# EasyEDA Pro project ORCA Logic Circuit Pro.epro

# Schematic ORCA Logic Circuit
Board Name: ORCA Logic Circuit; Create Date: 2025-01-24; Page Name: Sheet_1; Project Name: ORCA Logic Circuit Pro; Schematic Name: ORCA Logic Circuit; Update Date: 2025-01-24; Add into BOM: yes; Company: Your Company; Convert to PCB: yes; Date: 2025-01-24; Draw By: Nainaiu Rakhaine; REV: 1.0; Sheet: 1/1
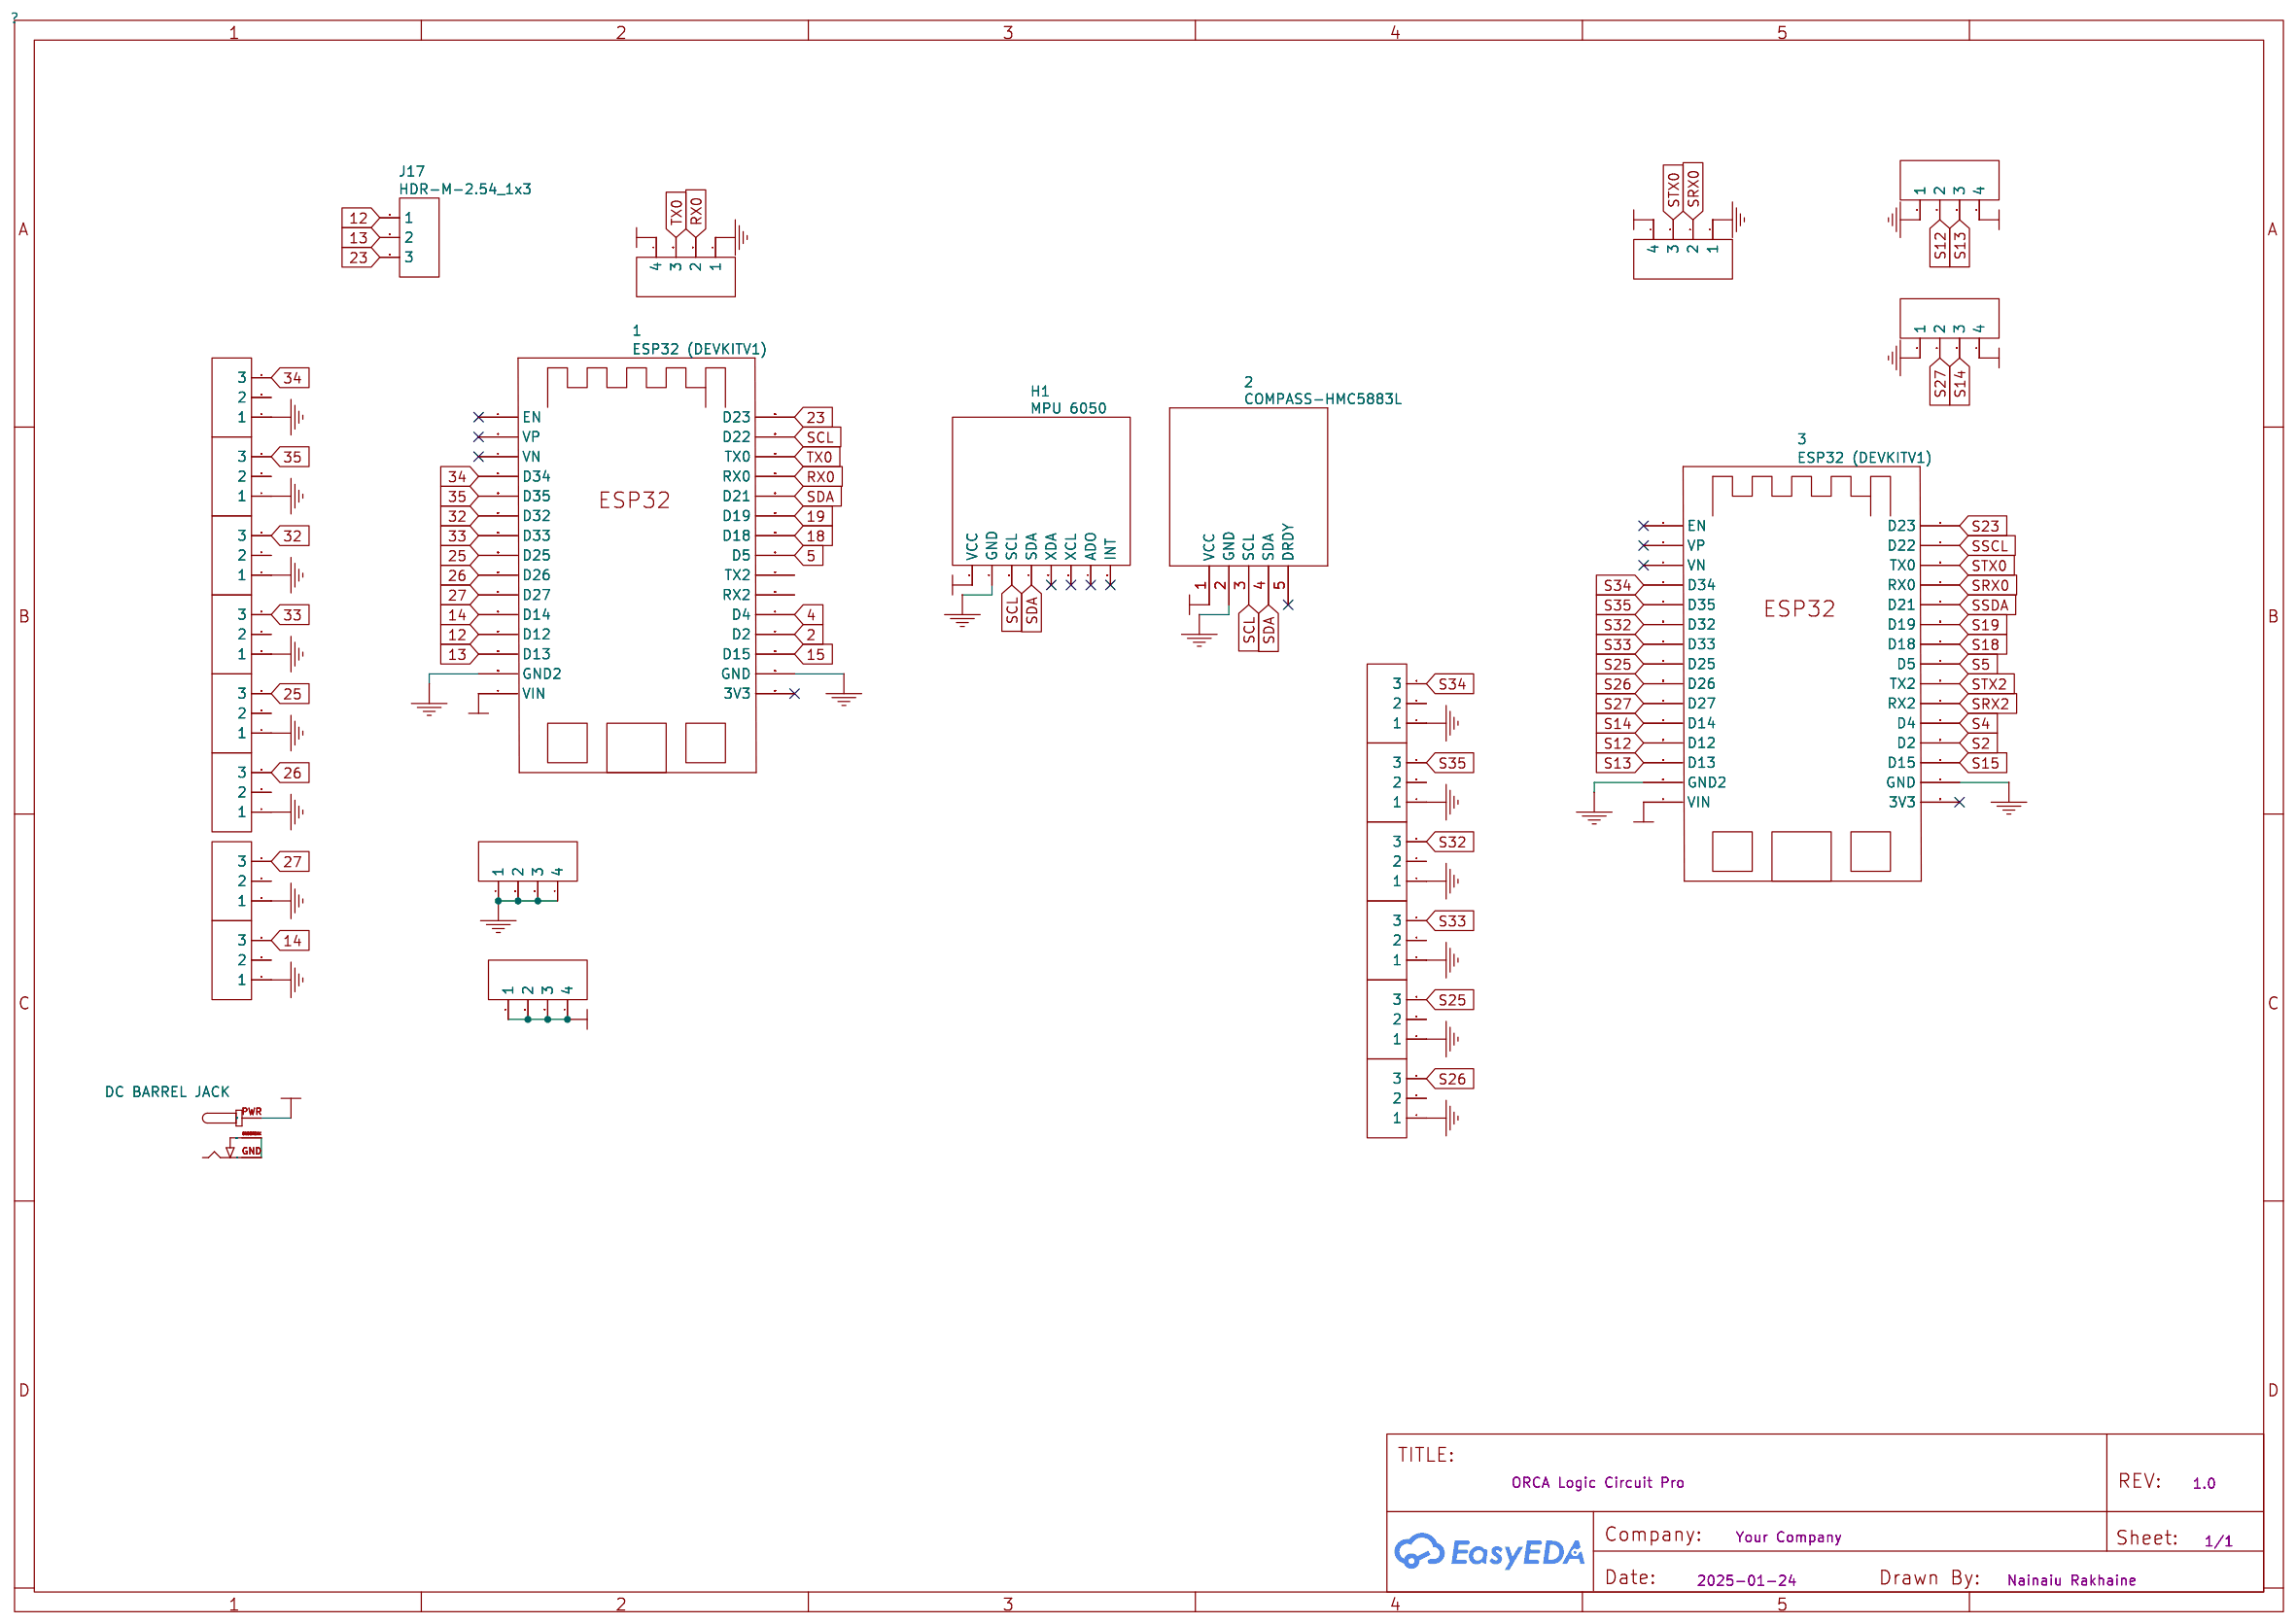
[diagram p0: schematic sheet]

## Parts
1  ESP32 (DEVKITV1)  [ESP32-DEVKIT1]
2  COMPASS-HMC5883L  [COMPASS-HMC5883L]
3  ESP32 (DEVKITV1)  [ESP32-DEVKIT1]
H1  MPU 6050  [MPU6050]
J1  HDR-M-2.54_1x4  [HDR-M-2.54_1X4]
J2  HDR-M-2.54_1x4  [HDR-M-2.54_1X4]
J3  HDR-M-2.54_1x3  [HDR-M-2.54_1X3]
J4  HDR-M-2.54_1x3  [HDR-M-2.54_1X3]
J5  HDR-M-2.54_1x3  [HDR-M-2.54_1X3]
J6  HDR-M-2.54_1x3  [HDR-M-2.54_1X3]
J7  HDR-M-2.54_1x3  [HDR-M-2.54_1X3]
J8  HDR-M-2.54_1x3  [HDR-M-2.54_1X3]
J9  HDR-M-2.54_1x3  [HDR-M-2.54_1X3]
J10  HDR-M-2.54_1x3  [HDR-M-2.54_1X3]
J11  HDR-M-2.54_1x3  [HDR-M-2.54_1X3]
J12  HDR-M-2.54_1x3  [HDR-M-2.54_1X3]
J13  HDR-M-2.54_1x3  [HDR-M-2.54_1X3]
J14  HDR-M-2.54_1x3  [HDR-M-2.54_1X3]
J15  HDR-M-2.54_1x4  [HDR-M-2.54_1X4]
J16  HDR-M-2.54_1x4  [HDR-M-2.54_1X4]
J17  HDR-M-2.54_1x3  [HDR-M-2.54_1X3]
J18  HDR-M-2.54_1x4  [HDR-M-2.54_1X4]
J19  HDR-M-2.54_1x3  [HDR-M-2.54_1X3]
J21  HDR-M-2.54_1x3  [HDR-M-2.54_1X3]
J22  HDR-M-2.54_1x4  [HDR-M-2.54_1X4]
U2  DC BARREL JACK  [DCBARRELJACK]

## Library data of the parts
1 3 = ESP32 (DEVKITV1)
2 = COMPASS-HMC5883L
H1 = MPU 6050: Supplier Part: C225505; Supplier: LCSC
J1 J2 J15 J16 J18 J22 = HDR-M-2.54_1x4: Supplier Part: C124378; Supplier: LCSC
J3-J14 J17 J19 J21 = HDR-M-2.54_1x3: Supplier Part: C180248; Supplier: LCSC
U2 = DC BARREL JACK

## Nets
+5V: 1.VIN 2.1(VCC) 3.VIN H1.1(VCC) J1.4 J15.1 J15.2 J15.3 J15.4 J16.4 J18.4 J22.4 U2.PWR
GND: 1.GND 1.GND2 2.2(GND) 3.GND 3.GND2 H1.2(GND) J1.1 J2.1 J2.2 J2.3 J2.4 J3.1 J4.1 J5.1 J6.1 J7.1 J8.1 J9.1 J10.1 J11.1 J12.1 J13.1 J14.1 J16.1 J18.1 J19.1 J21.1 J22.1
2: 1.D2
4: 1.D4
5: 1.D5
12: 1.D12 J17.1
13: 1.D13 J17.2
14: 1.D14 J5.3
15: 1.D15
18: 1.D18
19: 1.D19
23: 1.D23 J17.3
25: 1.D25 J8.3
26: 1.D26 J7.3
27: 1.D27 J6.3
32: 1.D32 J3.3
33: 1.D33 J4.3
34: 1.D34 J14.3
35: 1.D35 J13.3
RX0: 1.RX0 J16.2
S2: 3.D2
S4: 3.D4
S5: 3.D5
S12: 3.D12 J1.2
S13: 3.D13 J1.3
S14: 3.D14 J22.3
S15: 3.D15
S18: 3.D18
S19: 3.D19
S23: 3.D23
S25: 3.D25 J19.3
S26: 3.D26 J21.3
S27: 3.D27 J22.2
S32: 3.D32 J11.3
S33: 3.D33 J12.3
S34: 3.D34 J9.3
S35: 3.D35 J10.3
SCL: 1.D22 2.3(SCL) H1.3(SCL)
SDA: 1.D21 2.4(SDA) H1.4(SDA)
SRX0: 3.RX0 J18.2
SRX2: 3.RX2
SSCL: 3.D22
SSDA: 3.D21
STX0: 3.TX0 J18.3
STX2: 3.TX2
TX0: 1.TX0 J16.3
Net-(U2-GND): U2.GND U2.GNDBREAK

Not connected (* = marked no-connect by the designer): 1 3V3* EN* RX2 TX2 VN* VP*; 2 5(DRDY)*; 3 3V3* EN* VN* VP*; H1 5(XDA)* 6(XCL)* 7(ADO)* 8(INT)*; J3 2; J4 2; J5 2; J6 2; J7 2; J8 2; J9 2; J10 2; J11 2; J12 2; J13 2; J14 2; J19 2; J21 2

# Board PCB2
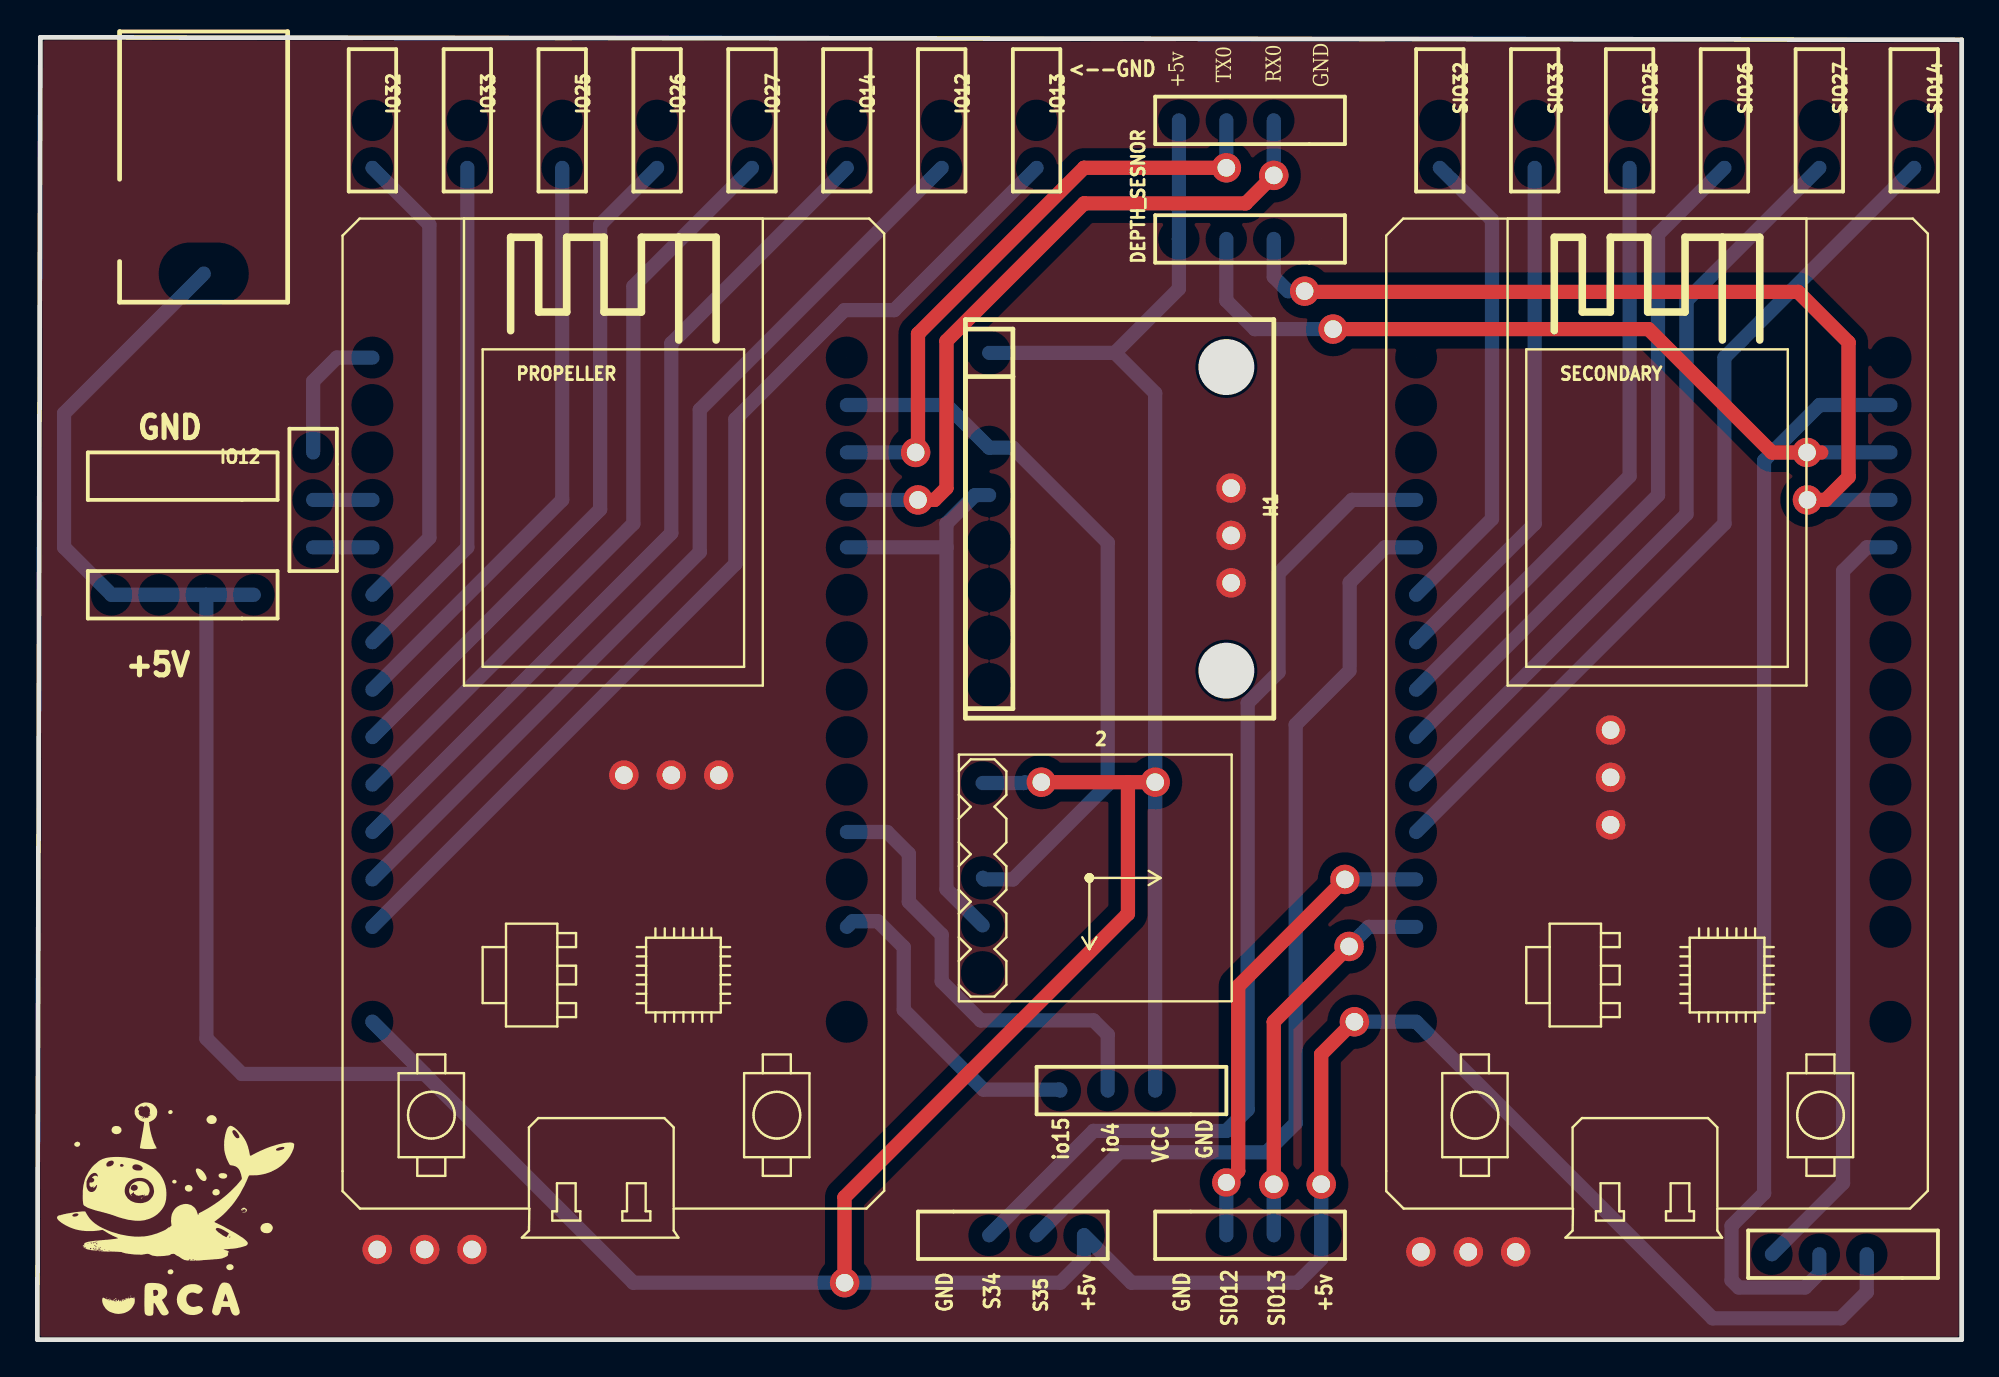
[diagram p1: board, top side]
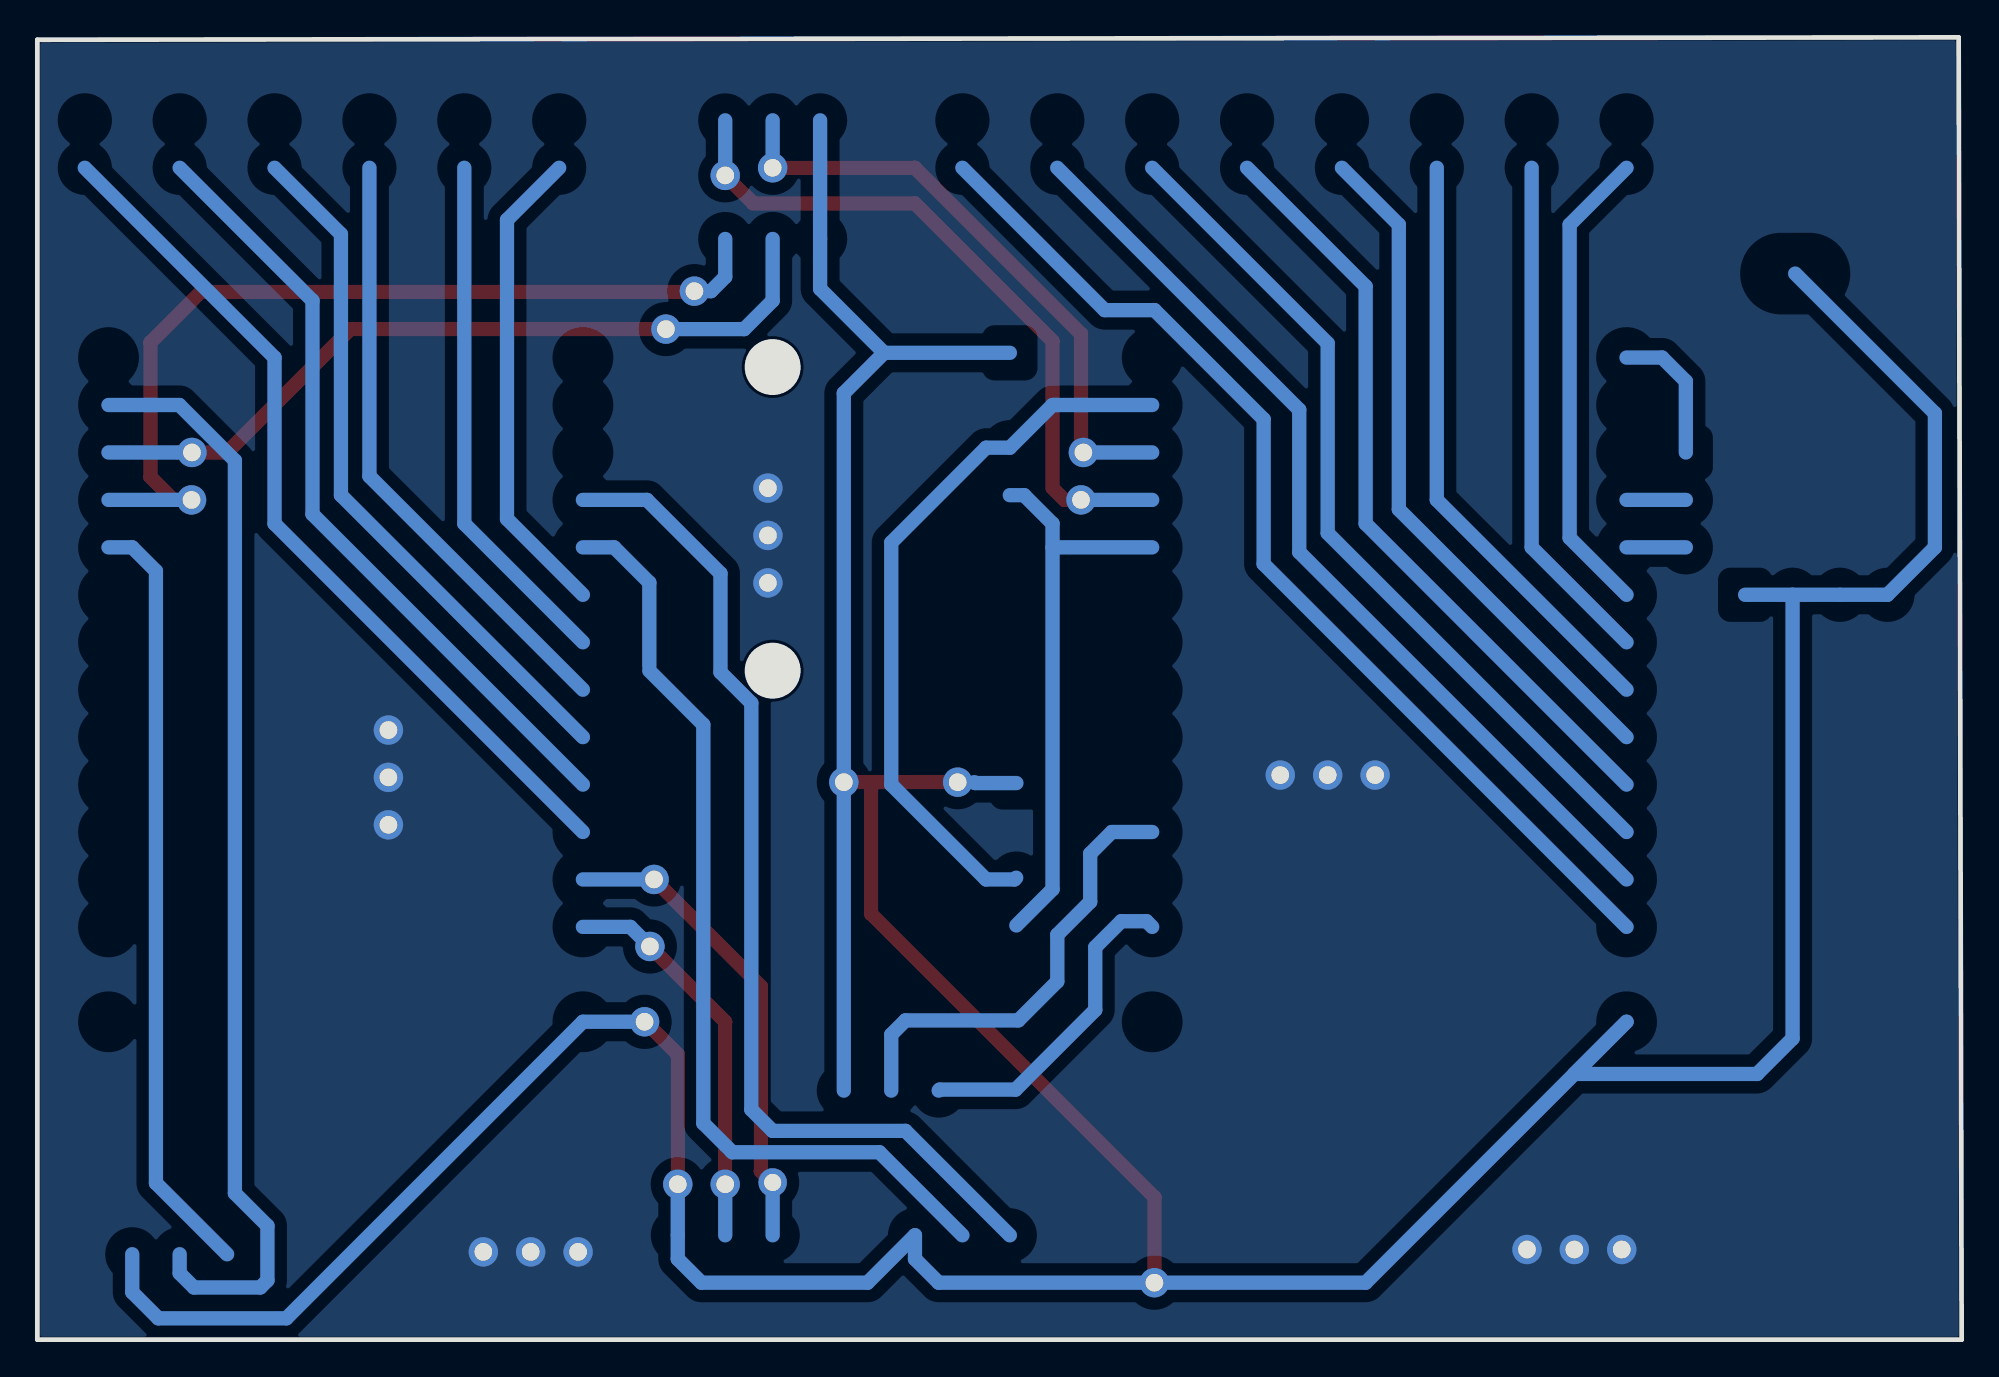
[diagram p2: board, bottom side, seen from below]

Outline 103.03 x 69.72 mm; copper layers: Top Layer, Bottom Layer. Coordinates in mm from the lower left corner of the outline.
Outline path: 0,0 0.16,69.72 103.03,69.59 103.03,0 0,0
Stack: Top Layer 0.035mm / Dielectric1 1.51mm FR4 er 4.5 / Bottom Layer 0.035mm

## Design rules (mm)
template: Custom Config
spacing copperThickness1oz (default): track to track 0.102, other pairs 0.152 to 0.3
spacing copperThickness2oz: track to track 0.203, other pairs 0.152 to 0.3
track width copperThickness1oz (default): min 0.127, default 0.254, max 2.54
track width copperThickness2oz: min 0.203, default 0.254, max 2.54
differential pair differentialPair (default): width min 0.127, default 0.254, max 2.54; gap min 0.152, default 0.152
via viaSize (default): diameter min 0.5, default 0.61, max 10; hole min 0.3, default 0.305, max 6.299
pour e205 uses copperRegion
pour e206 uses copperRegion

## Placement (name value [footprint] x y rotation side)
2  -  [COMPASS-HMC5883L]  56.04 24.64 0 top
+5V  HDR-M-2.54_1x4  [HDR-M-2.54_1X4]  7.78 39.88 180 top
DEPTH_SESNOR  HDR-M-2.54_1x4  [HDR-M-2.54_1X4]  64.93 65.28 180 top
DEPTH_SESNOR2  HDR-M-2.54_1x4  [HDR-M-2.54_1X4]  64.93 58.93 180 top
GND  HDR-M-2.54_1x4  [HDR-M-2.54_1X4]  7.78 46.23 180 top
H1  MPU 6050  [MPU6050]  58.58 48.77 270 top
IO12  -  [HDR-M-2.54_1X3]  48.42 65.28 270 top
IO12#2  -  [HDR-M-2.54_1X3]  14.77 44.96 270 top
IO13  HDR-M-2.54_1x3  [HDR-M-2.54_1X3]  53.5 65.28 270 top
IO14  HDR-M-2.54_1x3  [HDR-M-2.54_1X3]  43.34 65.28 270 top
IO25  HDR-M-2.54_1x3  [HDR-M-2.54_1X3]  28.1 65.28 270 top
IO26  HDR-M-2.54_1x3  [HDR-M-2.54_1X3]  33.18 65.28 270 top
IO27  HDR-M-2.54_1x3  [HDR-M-2.54_1X3]  38.26 65.28 270 top
IO32  HDR-M-2.54_1x3  [HDR-M-2.54_1X3]  17.94 65.28 270 top
IO33  HDR-M-2.54_1x3  [HDR-M-2.54_1X3]  23.02 65.28 270 top
J1  -  [HDR-M-2.54_1X4]  96.68 4.57 180 top
J1#2  -  [HDR-M-2.54_1X4]  64.93 5.59 0 top
J1#3  -  [HDR-M-2.54_1X4]  58.58 13.34 180 top
NOREF  -  [Pad_e2337]  74.08 4.7 180 top
NOREF#2  -  [Pad_e2336]  84.24 32.64 270 top
NOREF#3  -  [Pad_e806]  53.76 29.85 180 top
NOREF#4  -  [Pad_e861]  69.38 54.1 180 top
NOREF#5  -  [Pad_e946]  94.75 47.5 180 top
NOREF#6  -  [Pad_e2331]  63.92 40.52 270 top
NOREF#7  -  [Pad_e2341]  20.74 4.83 180 top
NOREF#8  -  [Pad_e2329]  33.94 30.23 180 top
NOREF#9  -  [Pad_e1261]  43.22 3.05 180 top
NOREF#10  -  [Pad_e2334]  84.24 27.56 270 top
NOREF#11  -  [Pad_e2330]  36.48 30.23 180 top
NOREF#12  -  [Pad_e1028]  66.2 8.32 180 top
NOREF#13  -  [Pad_e998]  94.78 44.96 180 top
NOREF#14  -  [Pad_e2328]  31.4 30.23 180 top
NOREF#15  -  [Pad_e2333]  63.92 45.59 270 top
NOREF#16  -  [Pad_e2335]  84.24 30.1 270 top
NOREF#17  -  [Pad_e862]  67.85 56.13 180 top
NOREF#18  -  [Pad_e1034]  68.74 8.32 180 top
NOREF#19  -  [Pad_e2342]  23.27 4.83 180 top
NOREF#20  -  [Pad_e1041]  70.01 24.64 180 top
NOREF#21  -  [Pad_e1057]  70.52 17.02 180 top
NOREF#22  -  [Pad_e837]  47.03 47.5 180 top
NOREF#23  -  [Pad_e2340]  18.2 4.83 180 top
NOREF#24  -  [Pad_e1042]  70.23 21.05 180 top
NOREF#25  -  [Pad_e2339]  79.15 4.7 180 top
NOREF#26  -  [Pad_e2332]  63.92 43.06 270 top
NOREF#27  -  [Pad_e852]  66.2 62.33 180 top
NOREF#28  -  [Pad_e1078]  59.85 29.85 180 top
NOREF#29  -  [Pad_e2338]  76.62 4.7 180 top
NOREF#30  -  [Pad_e836]  47.15 44.96 180 top
NOREF#31  -  [Pad_e368]  63.66 8.42 0 top
NOREF#32  -  [Pad_e851]  63.66 62.74 180 top
PROPELLER  ESP32 (DEVKITV1)  [ESP32-DEVKIT1]  30.64 34.8 0 top
S35  HDR-M-2.54_1x4  [HDR-M-2.54_1X4]  52.23 5.59 0 top
SECONDARY  ESP32 (DEVKITV1)  [ESP32-DEVKIT1]  86.52 34.8 0 top
SIO14  HDR-M-2.54_1x3  [HDR-M-2.54_1X3]  100.49 65.28 270 top
SIO25  HDR-M-2.54_1x3  [HDR-M-2.54_1X3]  85.25 65.28 270 top
SIO26  HDR-M-2.54_1x3  [HDR-M-2.54_1X3]  90.33 65.28 270 top
SIO27  HDR-M-2.54_1x3  [HDR-M-2.54_1X3]  95.41 65.28 270 top
SIO32  HDR-M-2.54_1x3  [HDR-M-2.54_1X3]  75.09 65.28 270 top
SIO33  HDR-M-2.54_1x3  [HDR-M-2.54_1X3]  80.17 65.28 270 top
U2  DC BARREL JACK  [DCBARRELJACK]  6.51 60.2 270 top

## Footprints (pads in the part's own frame, mm; a bottom-side part is the same pattern mirrored in y, then rotated)
COMPASS-HMC5883L
  rect 0.003x0.003 hole 1x1: 1(-5.43,5.16)
  round 0.003 hole 1x1: 2(-5.43,2.62) 3(-5.43,0.08) 4(-5.43,-2.46) 5(-5.43,-5)
DCBARRELJACK
  oval 0.003x0.003 hole 2x3.5: GND(-3.125,2.4) PWR(3.125,2.4)
  oval 0.003x0.003 hole 3.5x2: GNDBREAK(0.275,-2.4)
ESP32-DEVKIT1
  round 0.003 hole 0.914: 3V3(12.7,-17.78) D2(12.7,-10.16) D4(12.7,-7.62) D5(12.7,0) D12(-12.7,-10.16) D13(-12.7,-12.7) D14(-12.7,-7.62) D15(12.7,-12.7) D18(12.7,2.54) D19(12.7,5.08) D21(12.7,7.62) D22(12.7,15.24) D23(12.7,17.78) D25(-12.7,0) D26(-12.7,-2.54) D27(-12.7,-5.08) D32(-12.7,5.08) D33(-12.7,2.54) D34(-12.7,10.16) D35(-12.7,7.62) EN(-12.7,17.78) GND(12.7,-15.24) GND2(-12.7,-15.24) RX0(12.7,10.16) RX2(12.7,-5.08) TX0(12.7,12.7) TX2(12.7,-2.54) VIN(-12.7,-17.78) VN(-12.7,12.7) VP(-12.7,15.24)
HDR-M-2.54_1X3
  rect 0.003x0.003 hole 0.889: 1(-2.54,0)
  round 0.003 hole 0.889: 2(0,0) 3(2.54,0)
HDR-M-2.54_1X4
  rect 0.003x0.003 hole 0.889: 1(-3.81,0)
  round 0.003 hole 0.889: 2(-1.27,0) 3(1.27,0) 4(3.81,0)
MPU6050
  rect 0.003x0.003 hole 1.021: 1(-4.064,-7.62)
  round 0.003 hole 1.021: 2(-1.524,-7.62) 3(1.016,-7.62) 4(3.556,-7.62) 5(6.096,-7.62) 6(8.636,-7.62) 7(11.176,-7.62) 8(13.716,-7.62)
Pad_e368
  round 1.524 hole 0.914: 1(0,0)
Pad_e806
  round 1.575 hole 0.945: 1(0,0)
Pad_e836
  round 1.575 hole 0.945: 1(0,0)
Pad_e837
  round 1.575 hole 0.945: 2(0,0)
Pad_e851
  round 1.575 hole 0.945: 1(0,0)
Pad_e852
  round 1.575 hole 0.945: 2(0,0)
Pad_e861
  round 1.575 hole 0.945: 1(0,0)
Pad_e862
  round 1.575 hole 0.945: 2(0,0)
Pad_e946
  round 1.575 hole 0.945: 1(0,0)
Pad_e998
  round 1.575 hole 0.945: 1(0,0)
Pad_e1028
  round 1.575 hole 0.945: 2(0,0)
Pad_e1034
  round 1.575 hole 0.945: 3(0,0)
Pad_e1041
  round 1.575 hole 0.945: 1(0,0)
Pad_e1042
  round 1.575 hole 0.945: 2(0,0)
Pad_e1057
  round 1.575 hole 0.945: 1(0,0)
Pad_e1078
  round 1.575 hole 0.945: 1(0,0)
Pad_e1261
  round 1.575 hole 0.945: 1(0,0)
Pad_e2328
  round 1.575 hole 0.945: 1(0,0)
Pad_e2329
  round 1.575 hole 0.945: 1(0,0)
Pad_e2330
  round 1.575 hole 0.945: 1(0,0)
Pad_e2331
  round 1.575 hole 0.945: 1(0,0)
Pad_e2332
  round 1.575 hole 0.945: 1(0,0)
Pad_e2333
  round 1.575 hole 0.945: 1(0,0)
Pad_e2334
  round 1.575 hole 0.945: 1(0,0)
Pad_e2335
  round 1.575 hole 0.945: 1(0,0)
Pad_e2336
  round 1.575 hole 0.945: 1(0,0)
Pad_e2337
  round 1.575 hole 0.945: 1(0,0)
Pad_e2338
  round 1.575 hole 0.945: 1(0,0)
Pad_e2339
  round 1.575 hole 0.945: 1(0,0)
Pad_e2340
  round 1.575 hole 0.945: 1(0,0)
Pad_e2341
  round 1.575 hole 0.945: 1(0,0)
Pad_e2342
  round 1.575 hole 0.945: 1(0,0)

## Nets
+5V: 2.1 +5V.1 +5V.2 +5V.3 +5V.4 DEPTH_SESNOR.4 DEPTH_SESNOR2.4 H1.1 J1.2 J1#2.4 J1#3.2 NOREF#3.1 NOREF#9.1 NOREF#18.3 NOREF#21.1 NOREF#28.1 PROPELLER.VIN S35.4 SECONDARY.VIN U2.PWR
GND: 2.2 DEPTH_SESNOR.1 DEPTH_SESNOR2.1 GND.1 GND.2 GND.3 GND.4 H1.2 IO12.1 IO13.1 IO14.1 IO25.1 IO26.1 IO27.1 IO32.1 IO33.1 J1.1 J1#2.1 J1#3.1 NOREF.1 NOREF#2.1 NOREF#6.1 NOREF#7.1 NOREF#8.1 NOREF#10.1 NOREF#11.1 NOREF#14.1 NOREF#15.1 NOREF#16.1 NOREF#19.1 NOREF#23.1 NOREF#25.1 NOREF#26.1 NOREF#29.1 PROPELLER.GND PROPELLER.GND2 S35.1 SECONDARY.GND SECONDARY.GND2 SIO14.1 SIO25.1 SIO26.1 SIO27.1 SIO32.1 SIO33.1 U2.GND U2.GNDBREAK
1_RX2: PROPELLER.RX2
1_TX2: PROPELLER.TX2
2: PROPELLER.D2
4: J1#3.3 PROPELLER.D4
5: PROPELLER.D5
12: IO12.3 PROPELLER.D12
13: IO13.3 PROPELLER.D13
14: IO14.3 PROPELLER.D14
15: J1#3.4 PROPELLER.D15
18: PROPELLER.D18
19: PROPELLER.D19
23: PROPELLER.D23
25: IO25.3 PROPELLER.D25
26: IO26.3 PROPELLER.D26
27: IO27.3 PROPELLER.D27
32: IO32.3 PROPELLER.D32
33: IO33.3 PROPELLER.D33
34: IO12#2.2 PROPELLER.D34
35: IO12#2.3 PROPELLER.D35
EN: IO12#2.1 PROPELLER.EN
J3_2: IO25.2
J4_2: IO26.2
J5_2: IO13.2
J6_2: IO12.2
J7_2: IO14.2
J8_2: IO27.2
J9_2: SIO32.2
J10_2: SIO33.2
J11_2: SIO25.2
J12_2: SIO26.2
J13_2: IO33.2
J14_2: IO32.2
J19_2: SIO27.2
J21_2: SIO14.2
RX0: DEPTH_SESNOR.2 NOREF#27.2 NOREF#30.1 PROPELLER.RX0
S2: SECONDARY.D2
S4: SECONDARY.D4
S5: SECONDARY.D5
S12: J1#2.2 NOREF#20.1 NOREF#31.1 SECONDARY.D12
S13: J1#2.3 NOREF#12.2 NOREF#24.2 SECONDARY.D13
S14: SECONDARY.D14 SIO14.3
S15: SECONDARY.D15
S18: SECONDARY.D18
S19: SECONDARY.D19
S23: SECONDARY.D23
S25: SECONDARY.D25 SIO25.3
S26: SECONDARY.D26 SIO26.3
S27: SECONDARY.D27 SIO27.3
S32: SECONDARY.D32 SIO32.3
S33: SECONDARY.D33 SIO33.3
S34: S35.2 SECONDARY.D34
S35: S35.3 SECONDARY.D35
SCL: 2.3 H1.3 PROPELLER.D22
SDA: 2.4 H1.4 PROPELLER.D21
SRX0: DEPTH_SESNOR2.2 NOREF#13.1 NOREF#17.2 SECONDARY.RX0
SRX2: SECONDARY.RX2
SSCL: J1.3 SECONDARY.D22
SSDA: J1.4 SECONDARY.D21
STX0: DEPTH_SESNOR2.3 NOREF#4.1 NOREF#5.1 SECONDARY.TX0
STX2: SECONDARY.TX2
TX0: DEPTH_SESNOR.3 NOREF#22.2 NOREF#32.1 PROPELLER.TX0

Pads without a net: 2 5; H1 5 6 7 8; PROPELLER 3V3 VN VP; SECONDARY 3V3 EN VN VP

## Routing (per net, layer and track width the routed paths; a pad name or vN(x,y) marks a point on that pad's centre or on a via; arc(x,y) is an arc through that point)
+5V: length 281.3
  Top Layer w0.762: 58.39,29.85 59.47,29.85 59.6,29.97 ; 58.39,29.85 58.39,22.8 43.22,7.62 43.22,3.18 ; 58.39,29.85 NOREF#3.1 ; 70.48,17.02 68.74,15.28 68.74,8.45
  Bottom Layer w0.762: 57.69,52.83 61.12,56.26 DEPTH_SESNOR2.4 DEPTH_SESNOR.4 ; 57.69,52.83 H1.1 ; 57.69,52.83 59.85,50.67 NOREF#28.1 J1#3.2 ; 70.48,17.02 SECONDARY.VIN 89.7,1.14 96.56,1.14 97.95,2.54 J1.2 ; U2.PWR 1.43,49.59 1.43,42.42 +5V.4 +5V.3 +5V.2 ; 2.1 52.82,29.8 52.87,29.85 ; 68.74,8.45 J1#2.4 68.74,4.32 67.47,3.05 58.58,3.05 S35.4 56.04,4.32 54.77,3.05 NOREF#9.1 31.91,3.05 PROPELLER.VIN 20.74,14.22 10.95,14.22 9.05,16.12 +5V.2 ; +5V.2 +5V.1
4: length 24.4
  Bottom Layer w0.762: PROPELLER.D4 45.5,27.18 46.66,26.02 46.66,23.44 48.42,21.68 48.42,19.18 50.51,17.09 56.55,17.09 57.31,16.33 J1#3.3
12: length 50.7
  Bottom Layer w0.762: IO12.3 35.47,49.78 35.47,42.16 PROPELLER.D12
13: length 56.9
  Bottom Layer w0.762: IO13.3 45.88,55.12 43.22,55.12 37.37,49.28 37.37,41.53 PROPELLER.D13
14: length 46.1
  Bottom Layer w0.762: IO14.3 33.94,53.34 33.94,43.18 PROPELLER.D14
15: length 17.3
  Bottom Layer w0.762: J1#3.4 54.72,13.39 50.66,13.39 46.39,17.65 46.39,21.01 44.99,22.4 43.65,22.4 PROPELLER.D15
25: length 32.1
  Bottom Layer w0.762: IO25.3 28.1,44.96 PROPELLER.D25
26: length 36.8
  Bottom Layer w0.762: IO26.3 30.13,59.69 30.13,44.45 PROPELLER.D26
27: length 41.4
  Bottom Layer w0.762: IO27.3 31.91,56.39 31.91,43.69 PROPELLER.D27
32: length 25.4
  Bottom Layer w0.762: IO32.3 20.99,59.69 20.99,42.93 PROPELLER.D32
33: length 27.5
  Bottom Layer w0.762: IO33.3 23.02,42.42 PROPELLER.D33
34: length 3.2
  Bottom Layer w0.762: PROPELLER.D34 IO12#2.2
35: length 3.2
  Bottom Layer w0.762: PROPELLER.D35 IO12#2.3
EN: length 7.5
  Bottom Layer w0.762: IO12#2.1 14.77,51.31 16.04,52.58 PROPELLER.EN
RX0: length 37.6
  Top Layer w0.762: NOREF#27.2 64.7,60.83 56.04,60.83 48.68,53.47 48.68,45.59 48.04,44.96 NOREF#30.1
  Bottom Layer w0.762: NOREF#27.2 DEPTH_SESNOR.2 ; PROPELLER.RX0 NOREF#30.1
S12: length 25.5
  Top Layer w0.762: 63.66,8.38 64.3,9.02 64.3,18.92 NOREF#20.1
  Bottom Layer w0.762: J1#2.2 NOREF#31.1 ; NOREF#20.1 SECONDARY.D12
S13: length 21.2
  Top Layer w0.762: 66.2,8.45 66.2,17.02 NOREF#24.2
  Bottom Layer w0.762: SECONDARY.D13 71.28,22.1 NOREF#24.2 ; J1#2.3 66.2,8.45
S14: length 46.6
  Bottom Layer w0.762: SIO14.3 90.33,52.58 90.33,43.69 SECONDARY.D14
S25: length 32.7
  Bottom Layer w0.762: SECONDARY.D25 85.25,46.23 SIO25.3
S26: length 37.3
  Bottom Layer w0.762: SECONDARY.D26 86.78,45.21 86.78,59.18 SIO26.3
S27: length 42
  Bottom Layer w0.762: SIO27.3 88.3,55.63 88.3,44.2 SECONDARY.D27
S32: length 25.7
  Bottom Layer w0.762: SIO32.3 77.89,59.94 77.89,43.94 SECONDARY.D32
S33: length 28
  Bottom Layer w0.762: SECONDARY.D33 80.17,43.69 SIO33.3
S34: length 55
  Bottom Layer w0.762: S35.2 56.55,11.18 63.66,11.18 64.81,12.32 64.81,34.08 66.46,35.73 66.46,41.02 70.39,44.96 SECONDARY.D34
S35: length 50.6
  Bottom Layer w0.762: 70.27,36.07 70.27,40.53 72.15,42.42 SECONDARY.D35 ; S35.3 57.95,10.03 65.82,10.03 67.38,11.59 67.38,32.92 70.27,35.81
SCL: length 38.8
  Bottom Layer w0.762: 50.62,24.73 50.72,24.64 52.23,24.64 57.31,29.72 57.31,42.67 52.23,47.75 H1.3 48.68,50.04 PROPELLER.D22
SDA: length 30.6
  Bottom Layer w0.762: 48.68,42.42 48.68,43.69 50.2,45.21 H1.4 ; 48.68,42.42 48.68,24.11 2.4 ; 48.68,42.42 PROPELLER.D21
SRX0: length 49.2
  Top Layer w0.762: 67.77,56.09 94.27,56.09 96.98,53.39 96.98,46.19 95.75,44.96 94.52,44.96
  Bottom Layer w0.762: DEPTH_SESNOR2.2 66.2,56.9 66.96,56.13 NOREF#17.2 ; 94.52,44.96 SECONDARY.RX0
SSCL: length 58.8
  Bottom Layer w0.762: SECONDARY.D22 95.43,50.04 92.45,47.07 92.45,7.84 90.71,6.1 90.71,3.18 91.09,2.79 94.65,2.79 95.41,3.56 J1.3
SSDA: length 41.2
  Bottom Layer w0.762: SECONDARY.D21 97.95,42.42 96.68,41.15 96.68,8.38 J1.4
STX0: length 42.3
  Top Layer w0.762: 95.52,47.5 92.87,47.5 86.27,54.1 69.5,54.1 69.38,54.23
  Bottom Layer w0.762: DEPTH_SESNOR2.3 63.66,55.63 65.19,54.1 NOREF#4.1 ; 95.52,47.5 SECONDARY.TX0
TX0: length 32.7
  Top Layer w0.762: NOREF#32.1 56.04,62.74 47.15,53.85 47.15,47.75 46.9,47.5
  Bottom Layer w0.762: NOREF#32.1 DEPTH_SESNOR.3 ; PROPELLER.TX0 46.9,47.5

## Copper pours and planes (outline as drawn; the poured copper is in the pictures)
GND on Top Layer: -3.65,71.63 104.3,71.63 104.3,-1.75 -3.65,-0.98
GND on Bottom Layer: -1.11,70.36 104.3,70.36 104.3,-3.68 -1.11,-3.68

## Text on the board
Top Silkscreen Layer: GND | S34 | io15 | +5v | io4 | VCC | SIO12 | SIO13 | <--GND | TX0 | RX0

# Board PCB3
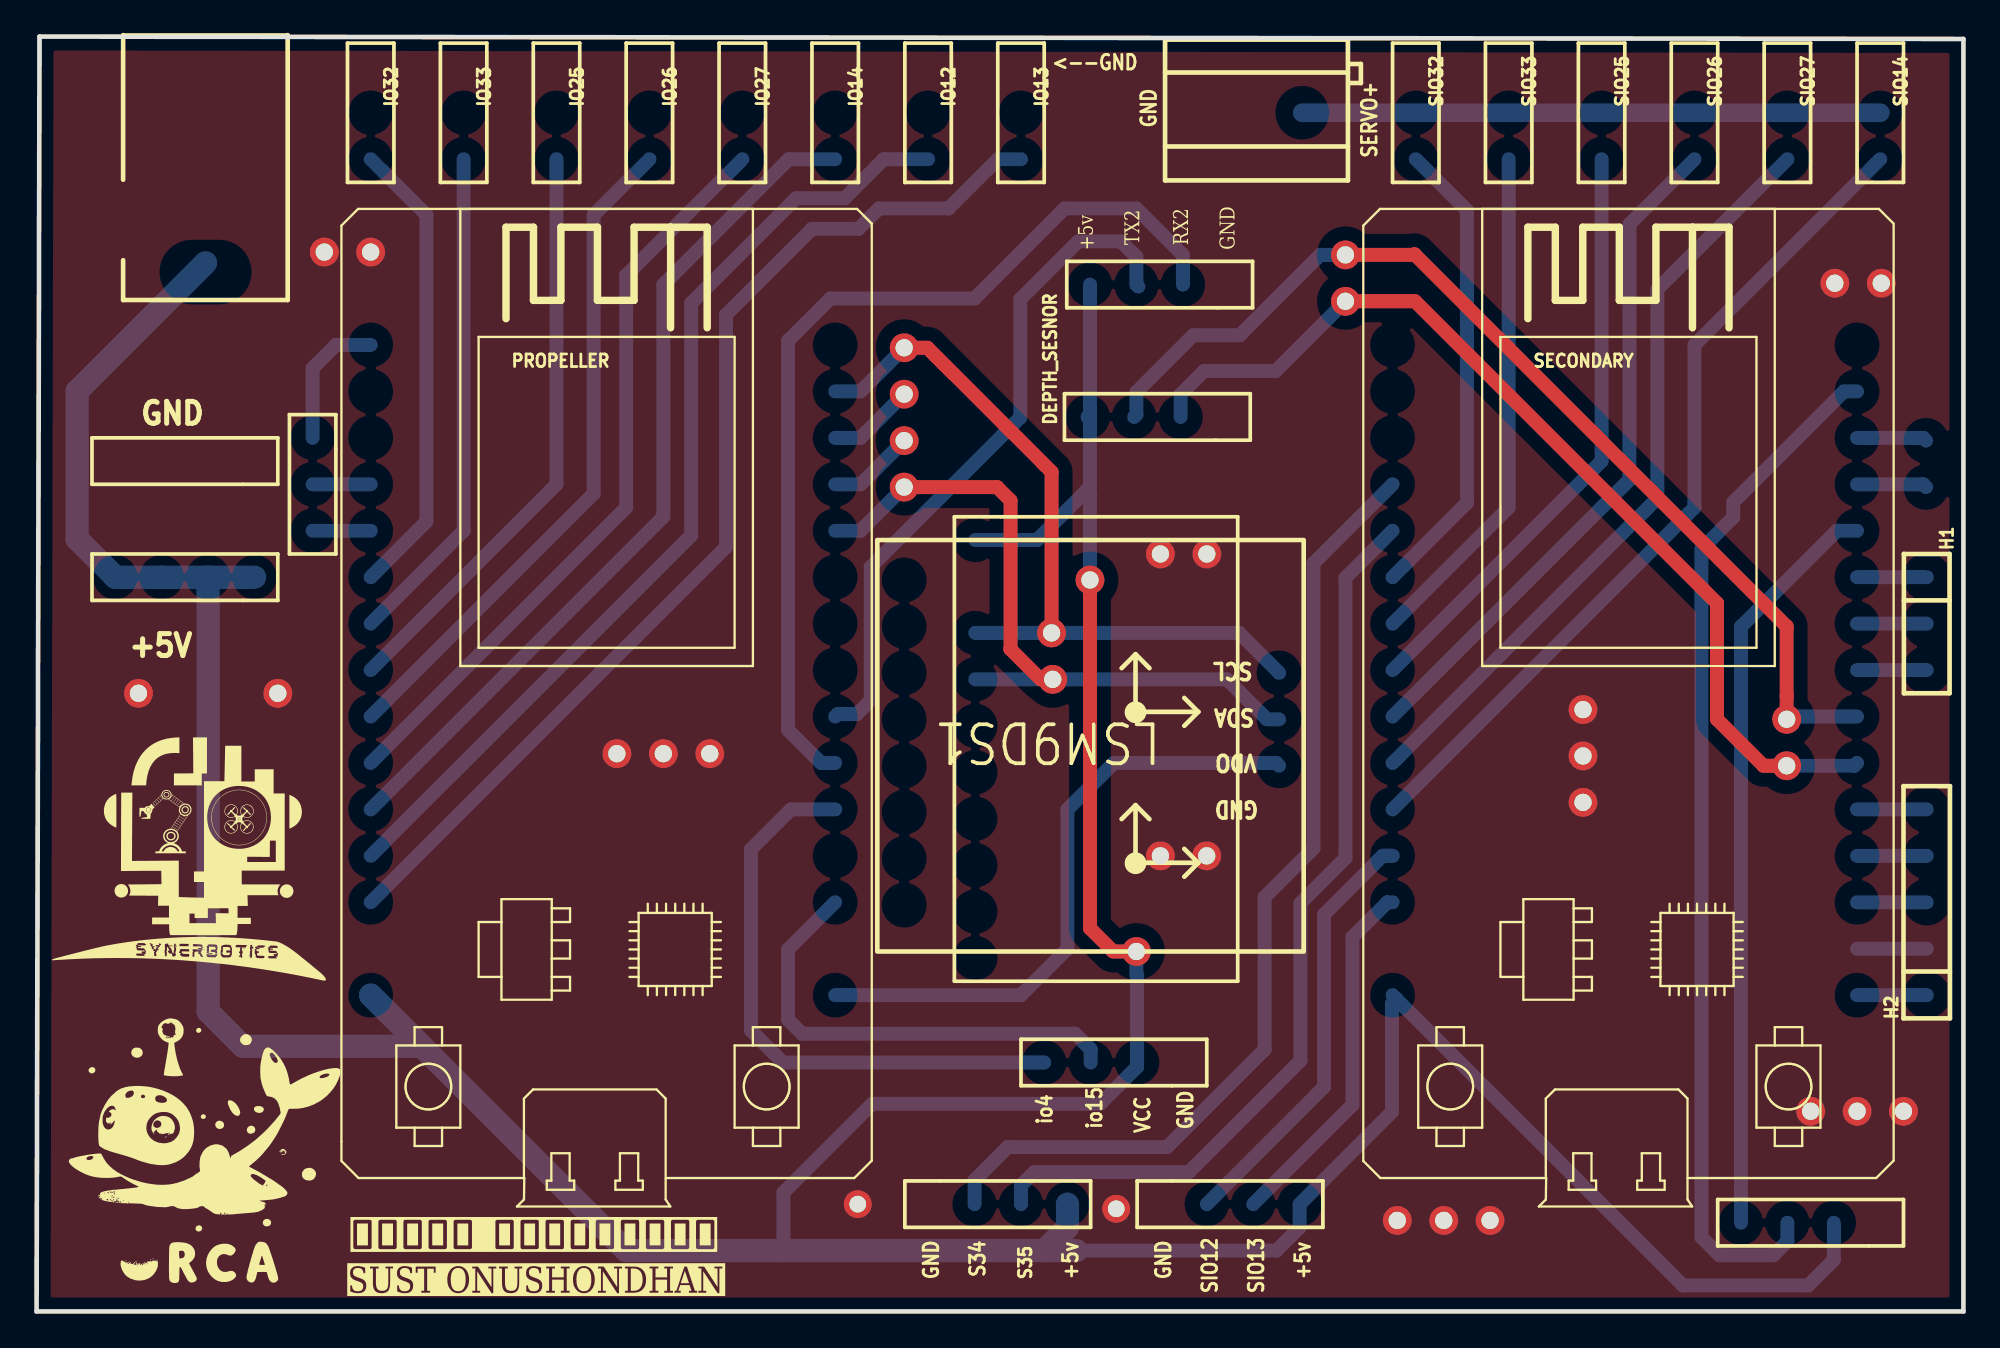
[diagram p3: board, top side]
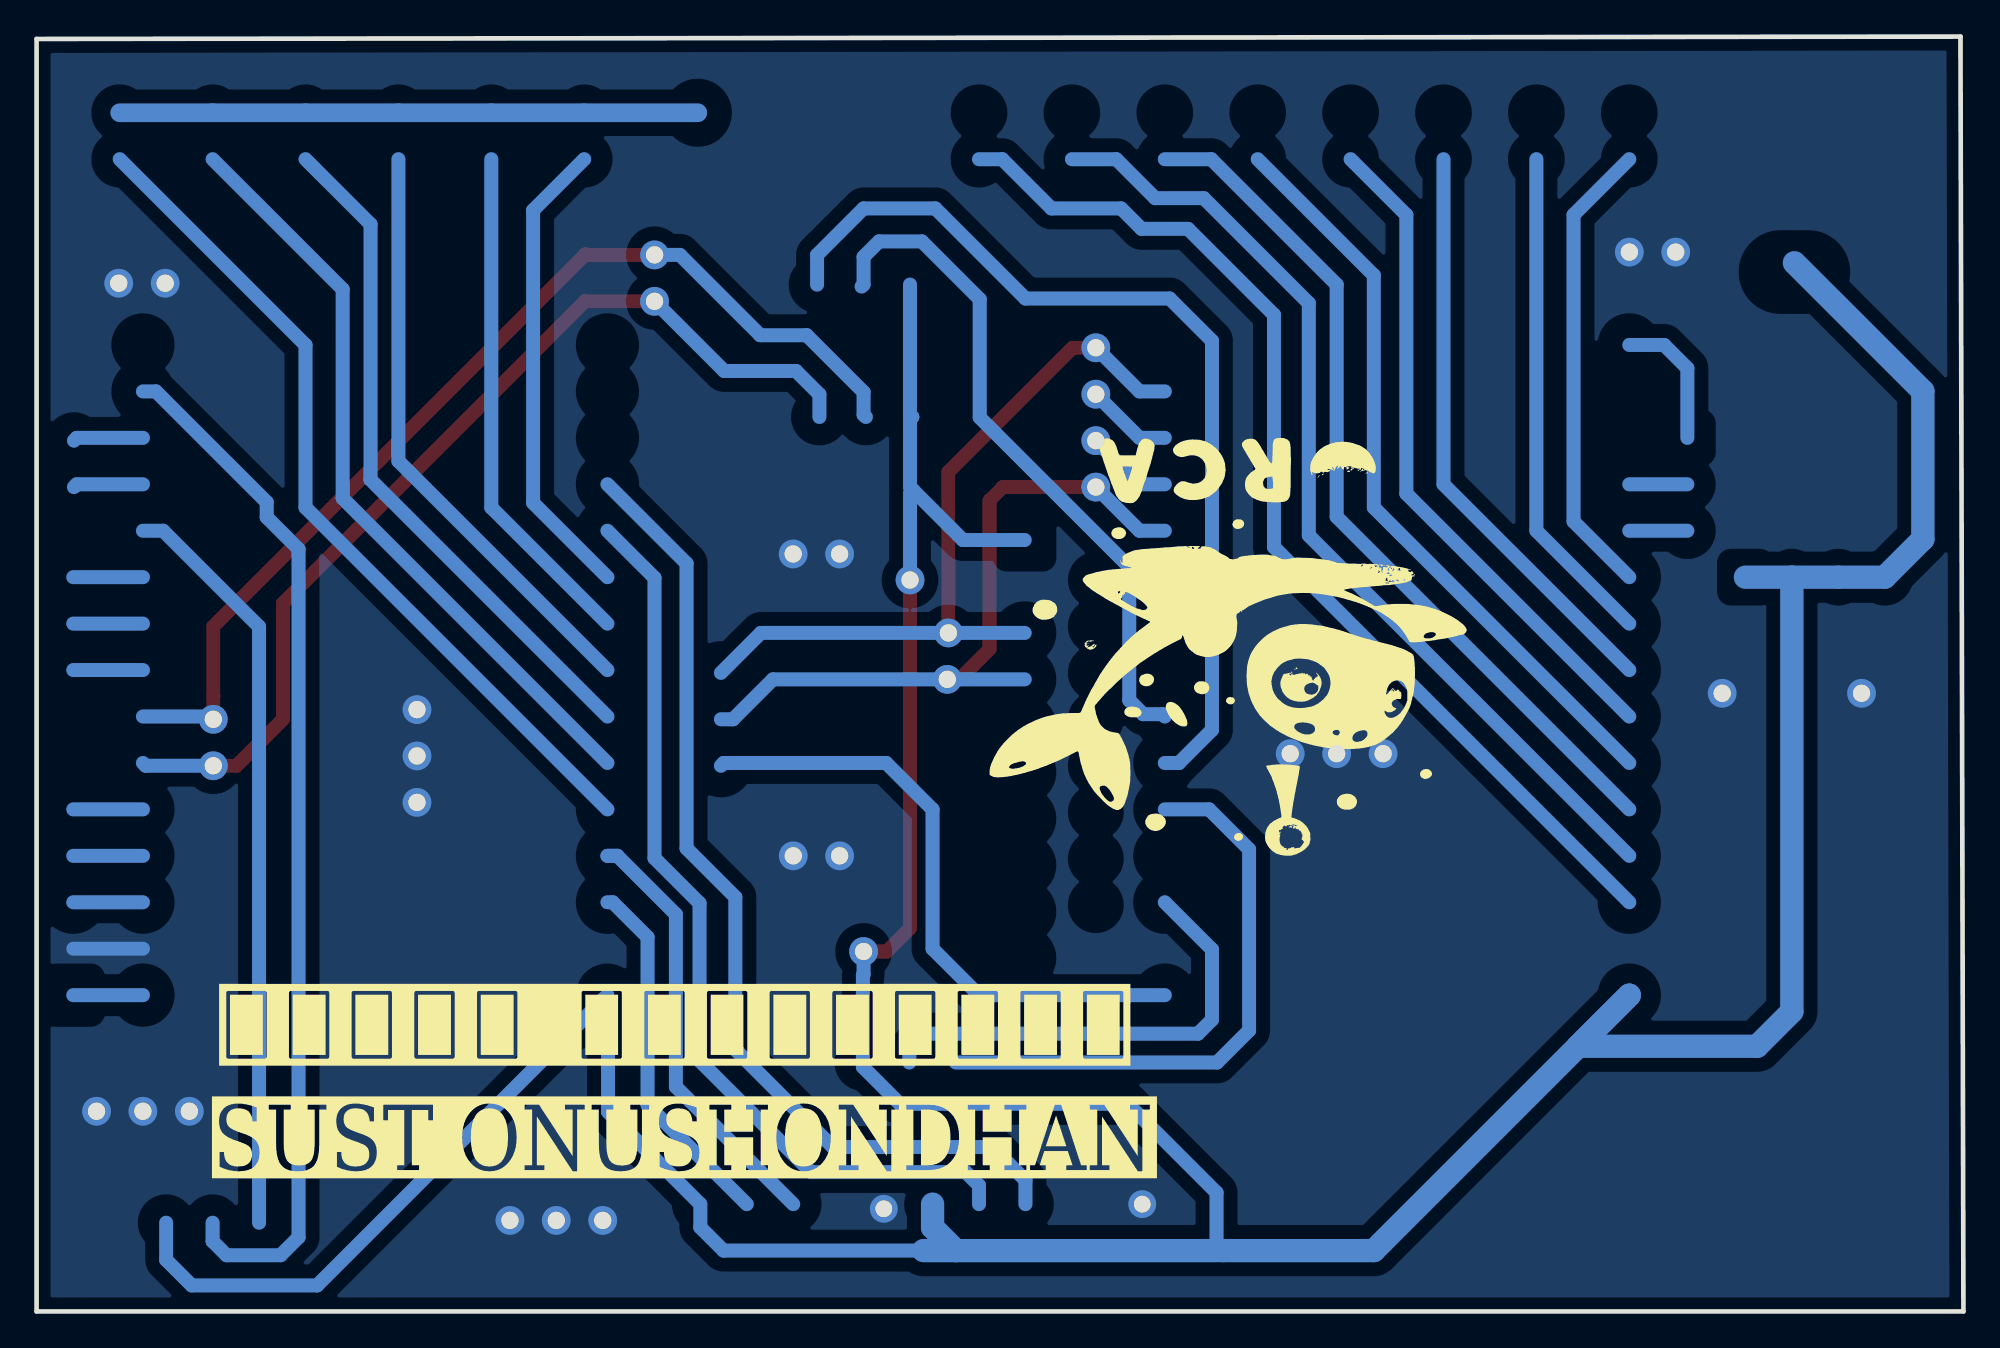
[diagram p4: board, bottom side, seen from below]

Outline 105.37 x 69.72 mm; copper layers: Top Layer, Bottom Layer. Coordinates in mm from the lower left corner of the outline.
Outline path: 0,0 0.16,69.72 105.37,69.59 105.37,0 0,0
Stack: Top Layer 0.035mm / Dielectric1 1.51mm FR4 er 4.5 / Bottom Layer 0.035mm

## Design rules (mm)
template: Custom Config
spacing copperThickness1oz (default): track to track 0.102, other pairs 0.152 to 0.3
spacing copperThickness2oz: track to track 0.203, other pairs 0.152 to 0.3
track width copperThickness1oz (default): min 0.127, default 0.254, max 2.54
track width copperThickness2oz: min 0.203, default 0.254, max 2.54
differential pair differentialPair (default): width min 0.127, default 0.254, max 2.54; gap min 0.152, default 0.152
via viaSize (default): diameter min 0.5, default 0.61, max 10; hole min 0.3, default 0.305, max 6.3

## Placement (name value [footprint] x y rotation side)
+5V  HDR-M-2.54_1x4  [HDR-M-2.54_1X4]  8.11 40.16 180 top
DEPTH_SESNOR  HDR-M-2.54_1x4  [HDR-M-2.54_1X4]  61.42 56.16 180 top
DEPTH_SESNOR2  HDR-M-2.54_1x4  [HDR-M-2.54_1X4]  61.29 48.92 180 top
GND  HDR-M-2.54_1x4  [HDR-M-2.54_1X4]  8.11 46.51 180 top
H1  -  [HDR-TH_3P-P2.54-V-M]  103.36 37.62 270 top
H2  -  [HDR-TH_5P-P2.54-V-M]  103.36 22.38 90 top
IN1  KF301-5.0-2P  [CONN-TH_P5.00_KF301-5.0-2P]  66.71 65.56 0 top
IO12  -  [HDR-M-2.54_1X3]  48.75 65.56 270 top
IO12#2  -  [HDR-M-2.54_1X3]  15.1 45.24 270 top
IO13  HDR-M-2.54_1x3  [HDR-M-2.54_1X3]  53.83 65.56 270 top
IO14  HDR-M-2.54_1x3  [HDR-M-2.54_1X3]  43.67 65.56 270 top
IO25  HDR-M-2.54_1x3  [HDR-M-2.54_1X3]  28.43 65.56 270 top
IO26  HDR-M-2.54_1x3  [HDR-M-2.54_1X3]  33.51 65.56 270 top
IO27  HDR-M-2.54_1x3  [HDR-M-2.54_1X3]  38.59 65.56 270 top
IO32  HDR-M-2.54_1x3  [HDR-M-2.54_1X3]  18.27 65.56 270 top
IO33  HDR-M-2.54_1x3  [HDR-M-2.54_1X3]  23.35 65.56 270 top
J1  -  [HDR-M-2.54_1X4]  97.01 4.85 180 top
J1#2  -  [HDR-M-2.54_1X4]  65.26 5.87 0 top
J1#3  -  [HDR-M-2.54_1X4]  58.91 13.61 180 top
NOREF  -  [Pad_e247]  31.73 30.51 180 top
NOREF#2  -  [Pad_e689]  47.44 45.09 180 top
NOREF#3  -  [Pad_e1896]  63.99 24.92 180 top
NOREF#4  -  [Pad_e232]  47.44 47.63 180 top
NOREF#5  -  [Pad_e1532]  102.09 10.95 180 top
NOREF#6  -  [Pad_e1671]  18.27 57.94 180 top
NOREF#7  -  [Pad_e236]  71.57 57.79 180 top
NOREF#8  -  [Pad_e258]  79.48 4.98 180 top
NOREF#9  -  [Pad_e1740]  100.88 56.24 0 top
NOREF#10  -  [Pad_e435]  95.7 29.85 270 top
NOREF#11  -  [Pad_e253]  84.57 27.84 270 top
NOREF#12  -  [Pad_e248]  34.27 30.51 180 top
NOREF#13  -  [Pad_e316]  47.44 37.47 180 top
NOREF#14  -  [Pad_e340]  60.14 19.69 180 top
NOREF#15  -  [Pad_e193]  47.44 34.93 180 top
NOREF#16  -  [Pad_e259]  5.57 33.81 180 top
NOREF#17  -  [Pad_e191]  47.44 29.85 180 top
NOREF#18  -  [Pad_e1460]  59.04 5.61 0 top
NOREF#19  -  [Pad_e194]  47.44 24.77 180 top
NOREF#20  -  [Pad_e254]  84.57 30.38 270 top
NOREF#21  -  [Pad_e239]  103.32 45.09 180 top
NOREF#22  -  [Pad_e1531]  99.55 10.95 180 top
NOREF#23  -  [Pad_e261]  13.19 33.81 180 top
NOREF#24  -  [Pad_e686]  55.57 34.57 180 top
NOREF#25  -  [Pad_e494]  44.91 5.87 0 top
NOREF#26  -  [Pad_e249]  36.81 30.51 180 top
NOREF#27  -  [Pad_e233]  47.44 50.17 180 top
NOREF#28  -  [Pad_e190]  47.44 27.31 180 top
NOREF#29  -  [Pad_e1897]  61.45 41.43 180 top
NOREF#30  -  [Pad_e255]  84.57 32.92 270 top
NOREF#31  -  [Pad_e192]  47.44 32.39 180 top
NOREF#32  -  [Pad_e1670]  15.73 57.94 180 top
NOREF#33  -  [Pad_e185]  67.95 27.31 180 top
NOREF#34  -  [Pad_e317]  47.44 40.01 180 top
NOREF#35  -  [Pad_e1895]  61.45 24.92 180 top
NOREF#36  -  [Pad_e334]  57.6 40.01 180 top
NOREF#37  -  [Pad_e683]  55.51 37.11 180 top
NOREF#38  -  [Pad_e1898]  63.99 41.43 180 top
NOREF#39  -  [Pad_e237]  71.57 55.25 180 top
NOREF#40  -  [Pad_e187]  67.95 32.39 180 top
NOREF#41  -  [Pad_e188]  67.95 34.93 180 top
NOREF#42  -  [Pad_e696]  47.44 52.71 180 top
NOREF#43  -  [Pad_e257]  76.95 4.98 180 top
NOREF#44  -  [Pad_e256]  74.41 4.98 180 top
NOREF#45  -  [Pad_e238]  103.32 47.63 180 top
NOREF#46  -  [Pad_e1530]  97.02 10.95 180 top
NOREF#47  -  [Pad_e197]  47.44 22.23 180 top
NOREF#48  -  [Pad_e1741]  98.34 56.24 0 top
NOREF#49  -  [Pad_e434]  95.7 32.39 270 top
NOREF#50  -  [Pad_e186]  67.95 29.85 180 top
PROPELLER  ESP32 (DEVKITV1)  [ESP32-DEVKIT1]  30.97 35.08 0 top
S35  HDR-M-2.54_1x4  [HDR-M-2.54_1X4]  52.56 5.87 0 top
SECONDARY  ESP32 (DEVKITV1)  [ESP32-DEVKIT1]  86.85 35.08 0 top
SIO14  HDR-M-2.54_1x3  [HDR-M-2.54_1X3]  100.82 65.56 270 top
SIO25  HDR-M-2.54_1x3  [HDR-M-2.54_1X3]  85.58 65.56 270 top
SIO26  HDR-M-2.54_1x3  [HDR-M-2.54_1X3]  90.66 65.56 270 top
SIO27  HDR-M-2.54_1x3  [HDR-M-2.54_1X3]  95.74 65.56 270 top
SIO32  HDR-M-2.54_1x3  [HDR-M-2.54_1X3]  75.42 65.56 270 top
SIO33  HDR-M-2.54_1x3  [HDR-M-2.54_1X3]  80.5 65.56 270 top
U2  DC BARREL JACK  [DCBARRELJACK]  6.84 59.97 270 top
U3  -  [MPU9250]  51.33 42.19 0 top

## Footprints (pads in the part's own frame, mm; a bottom-side part is the same pattern mirrored in y, then rotated)
CONN-TH_P5.00_KF301-5.0-2P
  round 0.003 hole 1.4: 1(-2.5,0) 2(2.5,0)
DCBARRELJACK
  oval 0.003x0.003 hole 2x3.5: GND(-3.125,2.4) PWR(3.125,2.4)
  oval 0.003x0.003 hole 3.5x2: GNDBREAK(0.275,-2.4)
ESP32-DEVKIT1
  round 0.003 hole 0.914: 3V3(12.7,-17.78) D2(12.7,-10.16) D4(12.7,-7.62) D5(12.7,0) D12(-12.7,-10.16) D13(-12.7,-12.7) D14(-12.7,-7.62) D15(12.7,-12.7) D18(12.7,2.54) D19(12.7,5.08) D21(12.7,7.62) D22(12.7,15.24) D23(12.7,17.78) D25(-12.7,0) D26(-12.7,-2.54) D27(-12.7,-5.08) D32(-12.7,5.08) D33(-12.7,2.54) D34(-12.7,10.16) D35(-12.7,7.62) EN(-12.7,17.78) GND(12.7,-15.24) GND2(-12.7,-15.24) RX0(12.7,10.16) RX2(12.7,-5.08) TX0(12.7,12.7) TX2(12.7,-2.54) VIN(-12.7,-17.78) VN(-12.7,12.7) VP(-12.7,15.24)
HDR-M-2.54_1X3
  rect 0.003x0.003 hole 0.889: 1(-2.54,0)
  round 0.003 hole 0.889: 2(0,0) 3(2.54,0)
HDR-M-2.54_1X4
  rect 0.003x0.003 hole 0.889: 1(-3.81,0)
  round 0.003 hole 0.889: 2(-1.27,0) 3(1.27,0) 4(3.81,0)
HDR-TH_3P-P2.54-V-M
  round 0.003 hole 1.1: 1(-2.54,0) 2(0,0) 3(2.54,0)
HDR-TH_5P-P2.54-V-M
  rect 0.003x0.003 hole 1.1x1.016: 1(-5.08,0)
  round 0.003 hole 1.1x1.016: 2(-2.54,0) 3(0,0) 4(2.54,0) 5(5.08,0)
MPU9250
  rect 0.003x0.003 hole 0.889: 1(0,0)
  round 0.003 hole 0.889: 2(0,-2.54) 3(0,-5.08) 4(0,-7.62) 5(0,-10.16) 6(0,-12.7) 7(0,-15.24) 8(0,-17.78) 9(0,-20.32) 10(0,-22.86)
Pad_e185
  rect 0.003x0.003 hole 0.914: 1(0,0)
Pad_e186
  round 0.003 hole 0.914: 2(0,0)
Pad_e187
  round 0.003 hole 0.914: 3(0,0)
Pad_e188
  round 0.003 hole 0.914: 4(0,0)
Pad_e190
  round 0.003 hole 0.914: 1(0,0)
Pad_e191
  round 0.003 hole 0.914: 2(0,0)
Pad_e192
  round 0.003 hole 0.914: 3(0,0)
Pad_e193
  round 0.003 hole 0.914: 4(0,0)
Pad_e194
  round 0.003 hole 0.914: 1(0,0)
Pad_e197
  round 0.003 hole 0.914: 4(0,0)
Pad_e232
  round 1.575 hole 0.945: 1(0,0)
Pad_e233
  round 1.575 hole 0.945: 2(0,0)
Pad_e236
  round 1.575 hole 0.945: 1(0,0)
Pad_e237
  round 1.575 hole 0.945: 2(0,0)
Pad_e238
  round 0.003 hole 0.945: 1(0,0)
Pad_e239
  round 0.003 hole 0.945: 1(0,0)
Pad_e247
  round 1.575 hole 0.945: 1(0,0)
Pad_e248
  round 1.575 hole 0.945: 1(0,0)
Pad_e249
  round 1.575 hole 0.945: 1(0,0)
Pad_e253
  round 1.575 hole 0.945: 1(0,0)
Pad_e254
  round 1.575 hole 0.945: 1(0,0)
Pad_e255
  round 1.575 hole 0.945: 1(0,0)
Pad_e256
  round 1.575 hole 0.945: 1(0,0)
Pad_e257
  round 1.575 hole 0.945: 1(0,0)
Pad_e258
  round 1.575 hole 0.945: 1(0,0)
Pad_e259
  round 1.575 hole 0.945: 1(0,0)
Pad_e261
  round 1.575 hole 0.945: 1(0,0)
Pad_e316
  round 0.003 hole 0.914: 4(0,0)
Pad_e317
  round 0.003 hole 0.914: 4(0,0)
Pad_e334
  round 1.575 hole 0.945: 1(0,0)
Pad_e340
  round 1.575 hole 0.945: 1(0,0)
Pad_e434
  round 1.575 hole 0.945: 1(0,0)
Pad_e435
  round 1.575 hole 0.945: 1(0,0)
Pad_e494
  round 1.524 hole 0.914: 1(0,0)
Pad_e683
  round 1.575 hole 0.945: 1(0,0)
Pad_e686
  round 1.575 hole 0.945: 1(0,0)
Pad_e689
  round 1.575 hole 0.945: 1(0,0)
Pad_e696
  round 1.575 hole 0.945: 1(0,0)
Pad_e1460
  round 1.524 hole 0.914: 1(0,0)
Pad_e1530
  round 1.575 hole 0.945: 1(0,0)
Pad_e1531
  round 1.575 hole 0.945: 1(0,0)
Pad_e1532
  round 1.575 hole 0.945: 1(0,0)
Pad_e1670
  round 1.575 hole 0.945: 1(0,0)
Pad_e1671
  round 1.575 hole 0.945: 1(0,0)
Pad_e1740
  round 1.575 hole 0.945: 1(0,0)
Pad_e1741
  round 1.575 hole 0.945: 1(0,0)
Pad_e1895
  round 1.575 hole 0.945: 1(0,0)
Pad_e1896
  round 1.575 hole 0.945: 1(0,0)
Pad_e1897
  round 1.575 hole 0.945: 1(0,0)
Pad_e1898
  round 1.575 hole 0.945: 1(0,0)

## Nets
3V3: H2.1 SECONDARY.3V3
+3.3V: NOREF#50.2 PROPELLER.3V3
+5V: +5V.1 +5V.2 +5V.3 +5V.4 DEPTH_SESNOR.4 DEPTH_SESNOR2.4 J1.2 J1#2.4 J1#3.2 NOREF#14.1 NOREF#36.1 PROPELLER.VIN S35.4 SECONDARY.VIN U2.PWR U3.1
GND: DEPTH_SESNOR.1 DEPTH_SESNOR2.1 GND.1 GND.2 GND.3 GND.4 H2.2 IN1.1 IO12.1 IO13.1 IO14.1 IO25.1 IO26.1 IO27.1 IO32.1 IO33.1 J1.1 J1#2.1 J1#3.1 NOREF.1 NOREF#3.1 NOREF#5.1 NOREF#6.1 NOREF#8.1 NOREF#9.1 NOREF#11.1 NOREF#12.1 NOREF#16.1 NOREF#18.1 NOREF#20.1 NOREF#22.1 NOREF#23.1 NOREF#25.1 NOREF#26.1 NOREF#29.1 NOREF#30.1 NOREF#32.1 NOREF#33.1 NOREF#35.1 NOREF#38.1 NOREF#43.1 NOREF#44.1 NOREF#46.1 NOREF#48.1 PROPELLER.GND PROPELLER.GND2 S35.1 SECONDARY.GND SECONDARY.GND2 SIO14.1 SIO25.1 SIO26.1 SIO27.1 SIO32.1 SIO33.1 U2.GND U2.GNDBREAK U3.2
SVIN: IN1.2 SIO14.2 SIO25.2 SIO26.2 SIO27.2 SIO32.2 SIO33.2
1_RX2: DEPTH_SESNOR.2 PROPELLER.RX2
1_TX2: DEPTH_SESNOR.3 PROPELLER.TX2
2: PROPELLER.D2
4: J1#3.4 PROPELLER.D4
5: PROPELLER.D5
12: IO12.3 PROPELLER.D12
13: IO13.3 PROPELLER.D13
14: IO14.3 PROPELLER.D14
15: J1#3.3 PROPELLER.D15
18: PROPELLER.D18
19: PROPELLER.D19
23: PROPELLER.D23
25: IO25.3 PROPELLER.D25
26: IO26.3 PROPELLER.D26
27: IO27.3 PROPELLER.D27
32: IO32.3 PROPELLER.D32
33: IO33.3 PROPELLER.D33
34: IO12#2.2 PROPELLER.D34
35: IO12#2.3 PROPELLER.D35
EN: IO12#2.1 PROPELLER.EN
J3_2: IO25.2
J4_2: IO26.2
J5_2: IO13.2
J6_2: IO12.2
J7_2: IO14.2
J8_2: IO27.2
J13_2: IO33.2
J14_2: IO32.2
RX0: NOREF#4.1 PROPELLER.RX0
S2: H2.4 SECONDARY.D2
S4: H2.5 SECONDARY.D4
S5: H1.3 SECONDARY.D5
S12: J1#2.2 SECONDARY.D12
S13: J1#2.3 SECONDARY.D13
S14: SECONDARY.D14 SIO14.3
S15: H2.3 SECONDARY.D15
S18: H1.2 SECONDARY.D18
S19: H1.1 SECONDARY.D19
S23: SECONDARY.D23
S25: SECONDARY.D25 SIO25.3
S26: SECONDARY.D26 SIO26.3
S27: SECONDARY.D27 SIO27.3
S32: SECONDARY.D32 SIO32.3
S33: SECONDARY.D33 SIO33.3
S34: S35.2 SECONDARY.D34
S35: S35.3 SECONDARY.D35
SCL: NOREF#37.1 NOREF#41.4 NOREF#42.1 PROPELLER.D22 U3.3
SDA: NOREF#2.1 NOREF#24.1 NOREF#40.3 PROPELLER.D21 U3.4
SRX0: NOREF#21.1 SECONDARY.RX0
SRX2: DEPTH_SESNOR2.2 NOREF#10.1 NOREF#39.2 SECONDARY.RX2
SSCL: J1.3 SECONDARY.D22
SSDA: J1.4 SECONDARY.D21
STX0: NOREF#45.1 SECONDARY.TX0
STX2: DEPTH_SESNOR2.3 NOREF#7.1 NOREF#49.1 SECONDARY.TX2
TX0: NOREF#27.2 PROPELLER.TX0

Pads without a net: NOREF#13 4; NOREF#15 4; NOREF#17 2; NOREF#19 1; NOREF#28 1; NOREF#31 3; NOREF#34 4; NOREF#47 4; PROPELLER VN VP; SECONDARY EN VN VP; U3 5 6 7 8 9 10

## Routing (per net, layer and track width the routed paths; a pad name or vN(x,y) marks a point on that pad's centre or on a via; arc(x,y) is an arc through that point)
3V3: length 3.8
  Bottom Layer w0.762: SECONDARY.3V3 H2.1
+3.3V: length 34.1
  Bottom Layer w0.762: NOREF#50.2 67.79,30 58.91,30 56.37,27.46 56.37,19.84 53.83,17.3 PROPELLER.3V3
+5V: length 254.5
  Top Layer w0.762: NOREF#36.1 57.6,20.96 58.87,19.69 NOREF#14.1
  Bottom Layer w0.762: DEPTH_SESNOR.4 57.61,49.05 DEPTH_SESNOR2.4 57.6,48.8 57.6,45.09 57.43,44.91 ; 56.87,3.33 67.8,3.33 69.07,4.6 J1#2.4 74.12,10.91 74.12,16.82 74.37,17.08 ; SECONDARY.VIN 74.37,17.08 ; 74.37,17.08 90.03,1.42 96.89,1.42 98.28,2.82 J1.2 ; 40.48,3.33 40.84,3.69 40.84,6.5 45.69,11.35 58.16,11.35 60.18,13.37 J1#3.2 60.18,18.38 60.14,18.42 NOREF#14.1 ; 57.43,44.91 57.6,44.74 NOREF#36.1 ; 57.43,44.91 54.71,42.19 U3.1
  Bottom Layer w1.27: 9.24,57.35 2.22,50.33 2.22,42.24 +5V.4 +5V.3 +5V.2 ; 55.1,3.33 56.87,3.33 ; 55.1,3.33 56.37,4.6 S35.4 ; 55.1,3.33 32.24,3.33 PROPELLER.VIN 21.07,14.5 11.28,14.5 9.38,16.4 +5V.2 ; +5V.2 +5V.1
GND: length 3.8
  Bottom Layer w0.762: SECONDARY.GND H2.2
SVIN: length 31.6
  Bottom Layer w1.016: SIO14.2 SIO27.2 SIO26.2 SIO25.2 SIO33.2 SIO32.2 IN1.2
1_RX2: length 51.9
  Bottom Layer w0.762: DEPTH_SESNOR.2 62.69,57.78 60.14,60.33 56.22,60.33 51.29,55.4 43.41,55.4 41.09,53.09 41.09,31.8 42.9,30 PROPELLER.RX2
1_TX2: length 37.3
  Bottom Layer w0.762: 60.25,56.05 60.14,56.16 60.14,57.68 59.3,58.52 56.96,58.52 53.79,55.36 53.79,48.9 45.62,40.72 45.62,33.43 44.85,32.66 43.8,32.66 PROPELLER.TX2
4: length 32.2
  Bottom Layer w0.762: J1#3.4 40.82,13.61 39.06,15.37 39.06,25.27 41.25,27.46 PROPELLER.D4
12: length 53.7
  Bottom Layer w0.762: PROPELLER.D12 35.8,42.44 35.8,55.14 41.54,60.89 44.2,60.89 46.33,63.02 IO12.3
13: length 59.8
  Bottom Layer w0.762: PROPELLER.D13 37.7,41.81 37.7,54.51 42.4,59.21 44.94,59.21 46.06,60.33 49.87,60.33 52.56,63.02 IO13.3
14: length 47.6
  Bottom Layer w0.762: IO14.3 41.13,63.02 34.27,56.16 34.27,43.46 PROPELLER.D14
15: length 25.4
  Bottom Layer w0.762: PROPELLER.D15 41.09,19.8 41.09,15.95 41.86,15.19 56.79,15.19 57.64,14.34 J1#3.3
25: length 32.1
  Bottom Layer w0.762: IO25.3 28.43,45.24 PROPELLER.D25
26: length 36.8
  Bottom Layer w0.762: PROPELLER.D26 30.46,44.73 30.46,59.97 IO26.3
27: length 41.4
  Bottom Layer w0.762: PROPELLER.D27 32.24,43.97 32.24,56.67 IO27.3
32: length 25.4
  Bottom Layer w0.762: IO32.3 21.32,59.97 21.32,43.21 PROPELLER.D32
33: length 27.5
  Bottom Layer w0.762: IO33.3 23.35,42.7 PROPELLER.D33
34: length 3.2
  Bottom Layer w0.762: PROPELLER.D34 IO12#2.2
35: length 3.2
  Bottom Layer w0.762: PROPELLER.D35 IO12#2.3
EN: length 7.5
  Bottom Layer w0.762: PROPELLER.EN 16.37,52.86 15.1,51.59 IO12#2.1
RX0: length 4.8
  Bottom Layer w0.762: PROPELLER.RX0 45.06,45.24 NOREF#4.1
S2: length 3.8
  Bottom Layer w0.762: SECONDARY.D2 H2.4
S4: length 3.8
  Bottom Layer w0.762: SECONDARY.D4 H2.5
S5: length 3.8
  Bottom Layer w0.762: SECONDARY.D5 H1.3
S12: length 24.1
  Bottom Layer w0.762: 73.61,24.92 70.41,21.72 70.41,12.28 J1#2.2 ; 73.61,24.92 SECONDARY.D12 73.61,24.92
S13: length 19.8
  Bottom Layer w0.762: SECONDARY.D13 73.86,22.38 71.96,20.47 71.96,11.29 J1#2.3
S14: length 46.6
  Bottom Layer w0.762: SECONDARY.D14 90.66,43.97 90.66,52.86 SIO14.3
S15: length 3.8
  Bottom Layer w0.762: SECONDARY.D15 H2.3
S18: length 3.8
  Bottom Layer w0.762: SECONDARY.D18 H1.2
S19: length 3.8
  Bottom Layer w0.762: SECONDARY.D19 H1.1
S25: length 32.7
  Bottom Layer w0.762: SIO25.3 85.58,46.51 SECONDARY.D25
S26: length 37.3
  Bottom Layer w0.762: SECONDARY.D26 87.11,45.49 87.11,59.46 SIO26.3
S27: length 42
  Bottom Layer w0.762: SIO27.3 88.63,55.91 88.63,44.48 SECONDARY.D27
S32: length 25.7
  Bottom Layer w0.762: SIO32.3 78.22,60.22 78.22,44.22 SECONDARY.D32
S33: length 28
  Bottom Layer w0.762: SIO33.3 80.5,43.97 SECONDARY.D33
S34: length 53.9
  Bottom Layer w0.762: SECONDARY.D34 69.82,40.91 69.82,25.32 67.16,22.66 67.16,14.33 61.82,8.99 53.11,8.99 51.29,7.17 S35.2
S35: length 50.2
  Bottom Layer w0.762: SECONDARY.D35 71.58,40.12 71.58,24.79 69.11,22.33 69.11,13.72 63.02,7.62 54.56,7.62 53.83,6.89 S35.3
SCL: length 42
  Top Layer w0.762: NOREF#42.1 48.71,52.71 55.51,45.92 NOREF#37.1
  Bottom Layer w0.762: NOREF#42.1 45.06,50.32 PROPELLER.D22 ; U3.3 65.76,37.11 NOREF#41.4
SDA: length 38.9
  Top Layer w0.762: NOREF#2.1 52.52,45.09 53.26,44.35 53.26,36.22 53.26,36.22 54.91,34.57
  Bottom Layer w0.762: NOREF#2.1 45.06,42.7 PROPELLER.D21 ; U3.4 65.1,34.57 67.28,32.39 NOREF#40.3
SRX0: length 3.8
  Bottom Layer w0.762: SECONDARY.RX0 103.17,45.24 NOREF#21.1
SRX2: length 54.6
  Top Layer w0.762: NOREF#39.2 75.38,55.25 91.89,38.74 91.89,32.39 94.43,29.85 NOREF#10.1
  Bottom Layer w0.762: DEPTH_SESNOR2.2 62.56,50.16 63.84,51.44 67.76,51.44 NOREF#39.2 ; SECONDARY.RX2 99.4,29.85 NOREF#10.1
SSCL: length 56.6
  Bottom Layer w0.762: J1.3 95.74,3.84 94.98,3.07 92.02,3.07 91.04,4.05 91.04,41.69 92.78,43.44 92.78,44.26 98.84,50.32 SECONDARY.D22
SSDA: length 41.1
  Bottom Layer w0.762: SECONDARY.D21 98.45,42.7 93.2,37.45 J1.4
STX0: length 3.8
  Bottom Layer w0.762: SECONDARY.TX0 103.17,47.78 NOREF#45.1
STX2: length 57.5
  Top Layer w0.762: NOREF#49.1 95.7,37.47 75.35,57.82 75.32,57.79 NOREF#7.1
  Bottom Layer w0.762: NOREF#7.1 70.19,57.79 65.8,53.39 63.26,53.39 60.14,50.28 60.14,49.05 DEPTH_SESNOR2.3 ; SECONDARY.TX2 95.86,32.54 NOREF#49.1
TX0: length 4.8
  Bottom Layer w0.762: NOREF#27.2 45.06,47.78 PROPELLER.TX0

## Copper pours and planes (outline as drawn; the poured copper is in the pictures)
GND on Top Layer: -0.43,70.64 105.36,70.64 105.36,-2.64 -0.43,-2.64
GND on Bottom Layer: -4.24,72.92 108.03,72.92 108.03,-2.77 -4.24,-2.77

## Text on the board
Bottom Silkscreen Layer: সাস্ট অনুসন্ধান | SUST ONUSHONDHAN
Top Silkscreen Layer: GND | S34 | io4 | +5v | io15 | VCC | SIO12 | SIO13 | <--GND | SERVO+ | SCL | SDA | VDO | LSM9DS1 | SUST ONUSHONDHAN | সাস্ট অনুসন্ধান | TX2 | RX2

# Board PCB_ORCA Logic Circuit
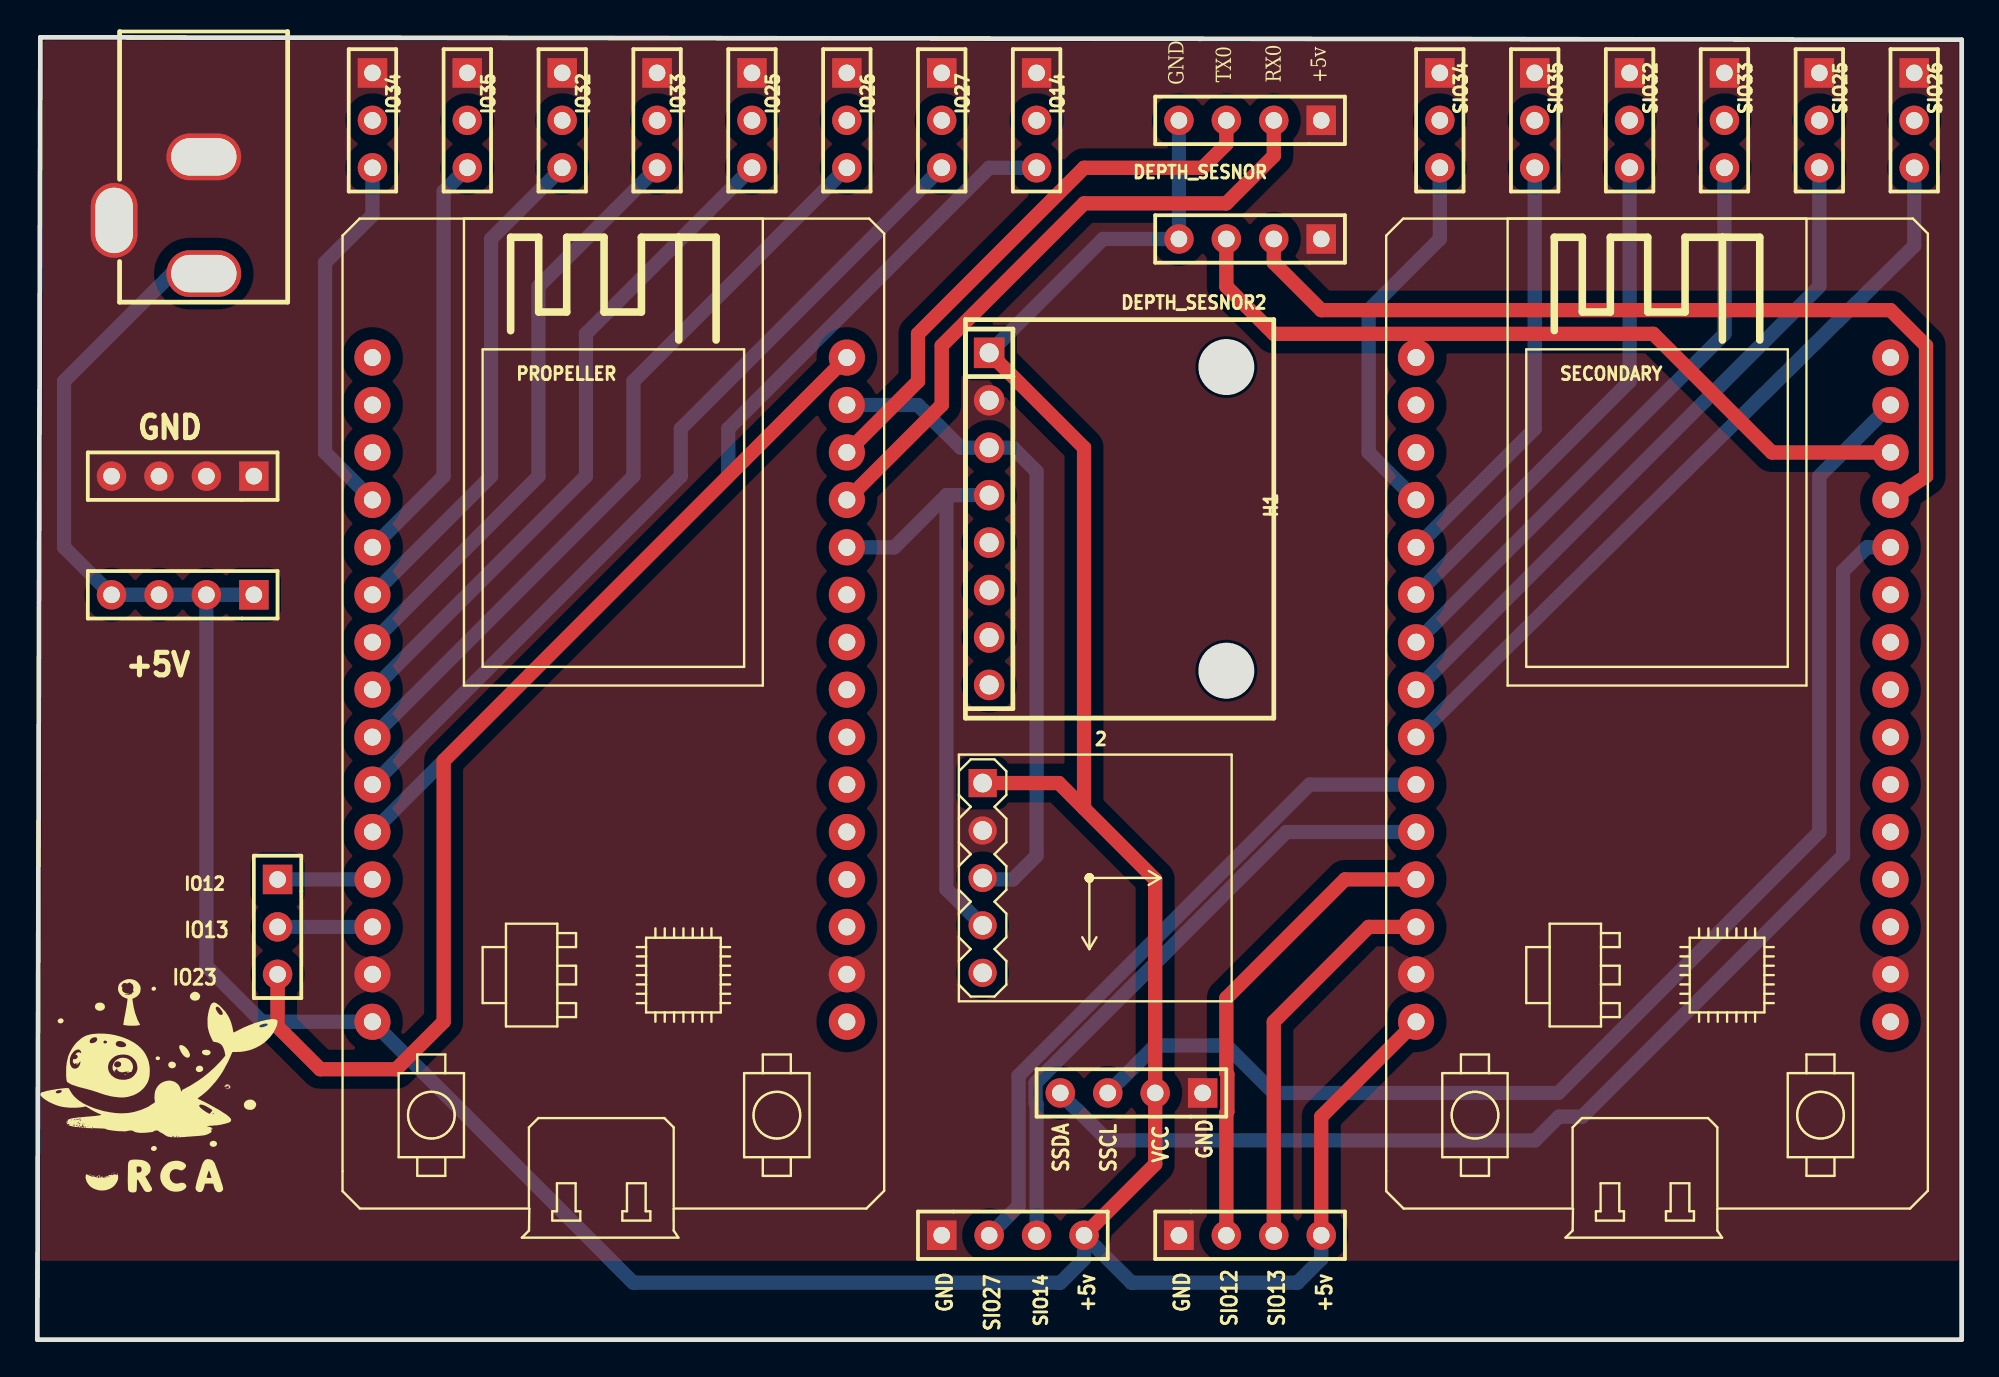
[diagram p5: board, top side]
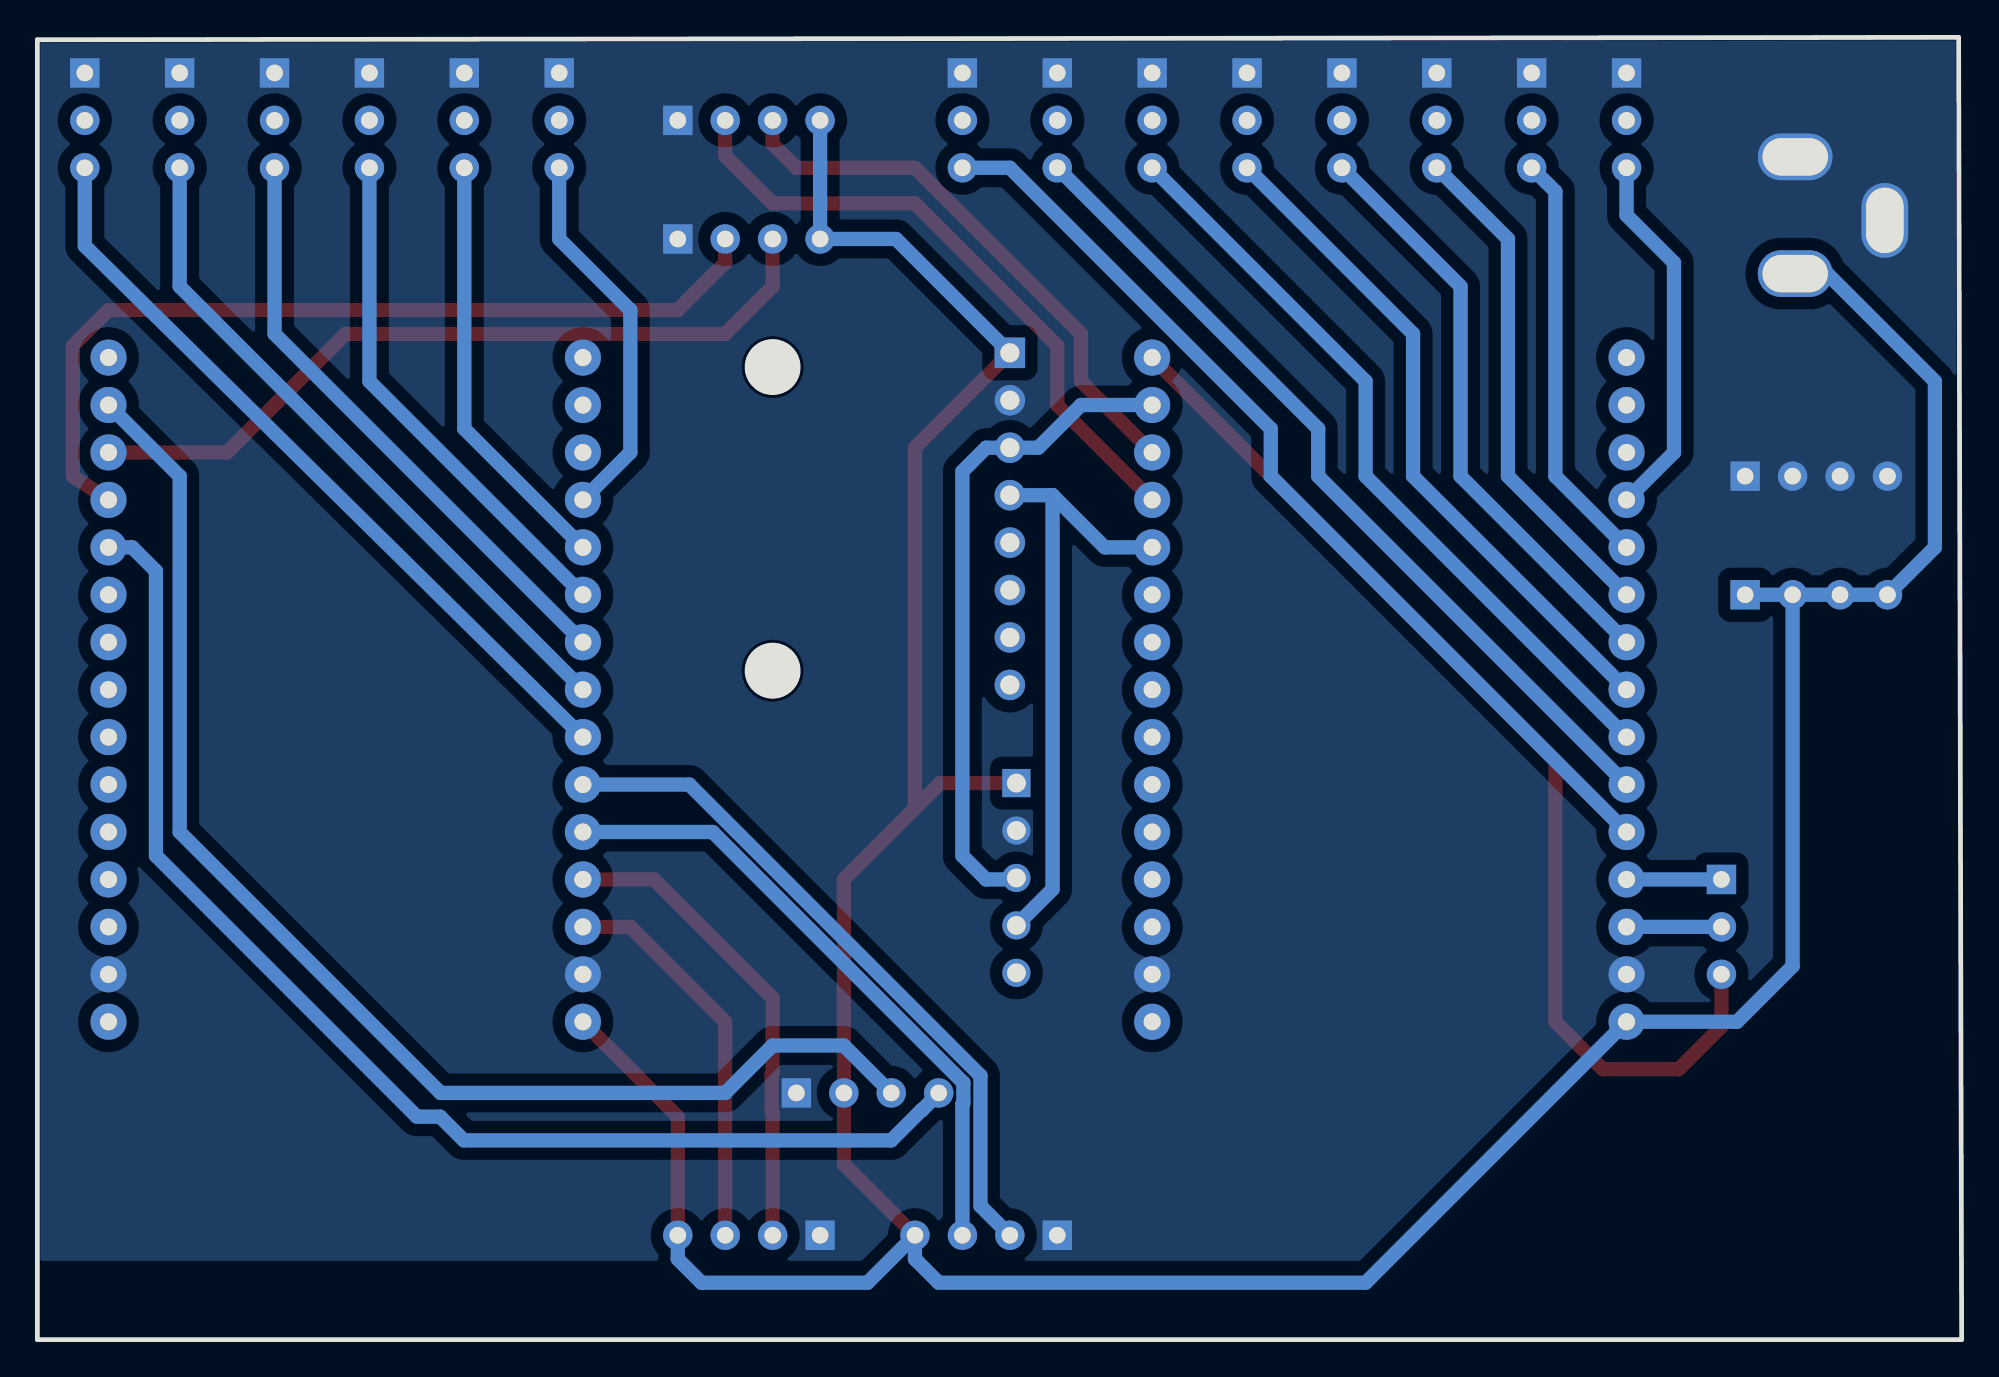
[diagram p6: board, bottom side, seen from below]

Outline 103.03 x 69.72 mm; copper layers: Top Layer, Bottom Layer. Coordinates in mm from the lower left corner of the outline.
Outline path: 0,0 0.16,69.72 103.03,69.59 103.03,0 0,0
Stack: Top Layer 0.035mm / Dielectric1 1.51mm FR4 er 4.5 / Bottom Layer 0.035mm

## Design rules (mm)
spacing Default (default): track to track 0.152, other pairs 0 to 0.152
track width Default (default): min 0.254, default 0.254, max 25.4
differential pair differentialPair (default): width min 0.127, default 0.254, max 2.54; gap min 0.152, default 0.152
via Default (default): diameter min 0.61, default 0.61, max 100.025; hole min 0.305, default 0.305, max 59.995
pour e84 uses gge4785
pour e446 uses gge4824

## Placement (name value [footprint] x y rotation side)
2  -  [COMPASS-HMC5883L]  56.04 24.64 0 top
+5V  HDR-M-2.54_1x4  [HDR-M-2.54_1X4]  7.78 39.88 180 top
DEPTH_SESNOR  HDR-M-2.54_1x4  [HDR-M-2.54_1X4]  64.93 65.28 180 top
DEPTH_SESNOR2  HDR-M-2.54_1x4  [HDR-M-2.54_1X4]  64.93 58.93 180 top
GND  HDR-M-2.54_1x4  [HDR-M-2.54_1X4]  7.78 46.23 180 top
H1  MPU 6050  [MPU6050]  58.58 48.77 270 top
IO12  HDR-M-2.54_1x3  [HDR-M-2.54_1X3]  12.86 22.1 270 top
IO14  HDR-M-2.54_1x3  [HDR-M-2.54_1X3]  53.5 65.28 270 top
IO25  HDR-M-2.54_1x3  [HDR-M-2.54_1X3]  38.26 65.28 270 top
IO26  HDR-M-2.54_1x3  [HDR-M-2.54_1X3]  43.34 65.28 270 top
IO27  HDR-M-2.54_1x3  [HDR-M-2.54_1X3]  48.42 65.28 270 top
IO32  HDR-M-2.54_1x3  [HDR-M-2.54_1X3]  28.1 65.28 270 top
IO33  HDR-M-2.54_1x3  [HDR-M-2.54_1X3]  33.18 65.28 270 top
IO34  HDR-M-2.54_1x3  [HDR-M-2.54_1X3]  17.94 65.28 270 top
IO35  HDR-M-2.54_1x3  [HDR-M-2.54_1X3]  23.02 65.28 270 top
J1  HDR-M-2.54_1x4  [HDR-M-2.54_1X4]  64.93 5.59 0 top
J1#2  -  [HDR-M-2.54_1X4]  58.58 13.21 180 top
PROPELLER  ESP32 (DEVKITV1)  [ESP32-DEVKIT1]  30.64 34.8 0 top
SECONDARY  ESP32 (DEVKITV1)  [ESP32-DEVKIT1]  86.52 34.8 0 top
SIO14  HDR-M-2.54_1x4  [HDR-M-2.54_1X4]  52.23 5.59 0 top
SIO25  HDR-M-2.54_1x3  [HDR-M-2.54_1X3]  95.41 65.28 270 top
SIO26  HDR-M-2.54_1x3  [HDR-M-2.54_1X3]  100.49 65.28 270 top
SIO32  HDR-M-2.54_1x3  [HDR-M-2.54_1X3]  85.25 65.28 270 top
SIO33  HDR-M-2.54_1x3  [HDR-M-2.54_1X3]  90.33 65.28 270 top
SIO34  HDR-M-2.54_1x3  [HDR-M-2.54_1X3]  75.09 65.28 270 top
SIO35  HDR-M-2.54_1x3  [HDR-M-2.54_1X3]  80.17 65.28 270 top
U2  DC BARREL JACK  [DCBARRELJACK]  6.51 60.2 270 top

## Footprints (pads in the part's own frame, mm; a bottom-side part is the same pattern mirrored in y, then rotated)
COMPASS-HMC5883L
  rect 1.508x1.508 hole 1x1: 1(-5.43,5.16)
  round 1.508 hole 1x1: 2(-5.43,2.62) 3(-5.43,0.08) 4(-5.43,-2.46) 5(-5.43,-5)
DCBARRELJACK
  oval 2.5x4 hole 2x3.5: GND(-3.125,2.4) PWR(3.125,2.4)
  oval 4x2.5 hole 3.5x2: GNDBREAK(0.275,-2.4)
ESP32-DEVKIT1
  round 1.931 hole 0.914: 3V3(12.7,-17.78) D2(12.7,-10.16) D4(12.7,-7.62) D5(12.7,0) D12(-12.7,-10.16) D13(-12.7,-12.7) D14(-12.7,-7.62) D15(12.7,-12.7) D18(12.7,2.54) D19(12.7,5.08) D21(12.7,7.62) D22(12.7,15.24) D23(12.7,17.78) D25(-12.7,0) D26(-12.7,-2.54) D27(-12.7,-5.08) D32(-12.7,5.08) D33(-12.7,2.54) D34(-12.7,10.16) D35(-12.7,7.62) EN(-12.7,17.78) GND(12.7,-15.24) GND2(-12.7,-15.24) RX0(12.7,10.16) RX2(12.7,-5.08) TX0(12.7,12.7) TX2(12.7,-2.54) VIN(-12.7,-17.78) VN(-12.7,12.7) VP(-12.7,15.24)
HDR-M-2.54_1X3
  rect 1.575x1.575 hole 0.889: 1(-2.54,0)
  round 1.575 hole 0.889: 2(0,0) 3(2.54,0)
HDR-M-2.54_1X4
  rect 1.575x1.575 hole 0.889: 1(-3.81,0)
  round 1.575 hole 0.889: 2(-1.27,0) 3(1.27,0) 4(3.81,0)
MPU6050
  rect 1.633x1.633 hole 1.021: 1(-4.064,-7.62)
  round 1.633 hole 1.021: 2(-1.524,-7.62) 3(1.016,-7.62) 4(3.556,-7.62) 5(6.096,-7.62) 6(8.636,-7.62) 7(11.176,-7.62) 8(13.716,-7.62)

## Nets
+5V: 2.1 +5V.1 +5V.2 +5V.3 +5V.4 DEPTH_SESNOR.4 DEPTH_SESNOR2.4 H1.1 J1.4 J1#2.2 PROPELLER.VIN SECONDARY.VIN SIO14.4 U2.PWR
GND: 2.2 DEPTH_SESNOR.1 DEPTH_SESNOR2.1 GND.1 GND.2 GND.3 GND.4 H1.2 IO14.1 IO25.1 IO26.1 IO27.1 IO32.1 IO33.1 IO34.1 IO35.1 J1.1 J1#2.1 PROPELLER.GND PROPELLER.GND2 SECONDARY.GND SECONDARY.GND2 SIO14.1 SIO25.1 SIO26.1 SIO32.1 SIO33.1 SIO34.1 SIO35.1 U2.GND U2.GNDBREAK
1_RX2: PROPELLER.RX2
1_TX2: PROPELLER.TX2
2: PROPELLER.D2
4: PROPELLER.D4
5: PROPELLER.D5
12: IO12.1 PROPELLER.D12
13: IO12.2 PROPELLER.D13
14: IO14.3 PROPELLER.D14
15: PROPELLER.D15
18: PROPELLER.D18
19: PROPELLER.D19
23: IO12.3 PROPELLER.D23
25: IO25.3 PROPELLER.D25
26: IO26.3 PROPELLER.D26
27: IO27.3 PROPELLER.D27
32: IO32.3 PROPELLER.D32
33: IO33.3 PROPELLER.D33
34: IO34.3 PROPELLER.D34
35: IO35.3 PROPELLER.D35
J3_2: IO32.2
J4_2: IO33.2
J5_2: IO14.2
J6_2: IO27.2
J7_2: IO26.2
J8_2: IO25.2
J9_2: SIO34.2
J10_2: SIO35.2
J11_2: SIO32.2
J12_2: SIO33.2
J13_2: IO35.2
J14_2: IO34.2
J19_2: SIO25.2
J21_2: SIO26.2
RX0: DEPTH_SESNOR.2 PROPELLER.RX0
S2: SECONDARY.D2
S4: SECONDARY.D4
S5: SECONDARY.D5
S12: J1.2 SECONDARY.D12
S13: J1.3 SECONDARY.D13
S14: SECONDARY.D14 SIO14.3
S15: SECONDARY.D15
S18: SECONDARY.D18
S19: SECONDARY.D19
S23: SECONDARY.D23
S25: SECONDARY.D25 SIO25.3
S26: SECONDARY.D26 SIO26.3
S27: SECONDARY.D27 SIO14.2
S32: SECONDARY.D32 SIO32.3
S33: SECONDARY.D33 SIO33.3
S34: SECONDARY.D34 SIO34.3
S35: SECONDARY.D35 SIO35.3
SCL: 2.3 H1.3 PROPELLER.D22
SDA: 2.4 H1.4 PROPELLER.D21
SRX0: DEPTH_SESNOR2.2 SECONDARY.RX0
SRX2: SECONDARY.RX2
SSCL: J1#2.3 SECONDARY.D22
SSDA: J1#2.4 SECONDARY.D21
STX0: DEPTH_SESNOR2.3 SECONDARY.TX0
STX2: SECONDARY.TX2
TX0: DEPTH_SESNOR.3 PROPELLER.TX0

Pads without a net: 2 5; H1 5 6 7 8; PROPELLER 3V3 EN VN VP; SECONDARY 3V3 EN VN VP

## Routing (per net, layer and track width the routed paths; a pad name or vN(x,y) marks a point on that pad's centre or on a via; arc(x,y) is an arc through that point)
+5V: length 212.3
  Top Layer w0.762: SECONDARY.VIN 68.74,11.94 J1.4 ; SIO14.4 59.85,9.4 J1#2.2 59.85,24.64 56.04,28.45 ; H1.1 56.04,47.75 56.04,28.45 ; 56.04,28.45 54.69,29.8 2.1
  Bottom Layer w0.762: DEPTH_SESNOR.4 DEPTH_SESNOR2.4 57.06,58.93 H1.1 ; +5V.2 9.05,19.99 12.03,17.02 PROPELLER.VIN 31.91,3.05 54.77,3.05 56.04,4.32 SIO14.4 58.58,3.05 67.47,3.05 68.74,4.32 J1.4 ; +5V.2 +5V.3 +5V.4 1.43,42.42 1.43,51.31 7.2,57.07 U2.PWR ; +5V.2 +5V.1
12: length 5.1
  Bottom Layer w0.762: IO12.1 PROPELLER.D12
13: length 5.1
  Bottom Layer w0.762: IO12.2 PROPELLER.D13
14: length 51.8
  Bottom Layer w0.762: PROPELLER.D14 36.99,46.23 36.99,48.77 50.96,62.74 IO14.3
23: length 58.2
  Top Layer w0.762: IO12.3 12.86,16.76 15.14,14.48 19.21,14.48 21.75,17.02 21.75,30.99 PROPELLER.D23
25: length 36.4
  Bottom Layer w0.762: PROPELLER.D25 29.37,46.23 29.37,53.85 IO25.3
26: length 41
  Bottom Layer w0.762: PROPELLER.D26 31.91,46.23 31.91,51.31 IO26.3
27: length 45.6
  Bottom Layer w0.762: PROPELLER.D27 34.45,46.23 34.45,48.77 IO27.3
32: length 27.1
  Bottom Layer w0.762: PROPELLER.D32 24.29,46.23 24.29,58.93 IO32.3
33: length 31.7
  Bottom Layer w0.762: PROPELLER.D33 26.83,46.23 26.83,56.39 IO33.3
34: length 19.9
  Bottom Layer w0.762: IO34.3 17.94,60.2 15.4,57.66 15.4,47.5 PROPELLER.D34
35: length 22.4
  Bottom Layer w0.762: PROPELLER.D35 21.75,46.23 21.75,61.47 IO35.3
RX0: length 34.3
  Top Layer w0.762: DEPTH_SESNOR.2 66.2,63.37 63.66,60.83 56.04,60.83 48.42,53.21 48.42,50.04 PROPELLER.RX0
S12: length 25.5
  Top Layer w0.762: SECONDARY.D12 70.01,24.64 63.66,18.29 63.66,14.27 63.71,14.22 63.71,12.2 63.66,12.15 J1.2
S13: length 21.2
  Top Layer w0.762: SECONDARY.D13 71.28,22.1 66.2,17.02 J1.3
S14: length 34.1
  Bottom Layer w0.762: SECONDARY.D14 66.87,27.18 53.45,13.76 53.45,12.66 53.5,12.61 SIO14.3
S25: length 36.9
  Bottom Layer w0.762: SECONDARY.D25 95.41,56.39 SIO25.3
S26: length 41.6
  Bottom Layer w0.762: SECONDARY.D26 100.49,58.56 SIO26.3
S27: length 36.9
  Bottom Layer w0.762: SIO14.2 52.54,7.16 52.54,14.13 68.12,29.72 SECONDARY.D27
S32: length 27.6
  Bottom Layer w0.762: SIO32.3 85.25,51.31 SECONDARY.D32
S33: length 32.2
  Bottom Layer w0.762: SECONDARY.D33 90.33,53.85 SIO33.3
S34: length 20.4
  Bottom Layer w0.762: SECONDARY.D34 71.28,47.5 71.28,55.12 75.09,58.93 SIO34.3
S35: length 23
  Bottom Layer w0.762: SIO35.3 80.17,48.77 SECONDARY.D35
SCL: length 35.6
  Bottom Layer w0.762: PROPELLER.D22 47.15,50.04 49.44,47.75 H1.3 52.23,47.75 53.5,46.48 53.5,25.91 52.23,24.64 50.72,24.64 50.62,24.73
SDA: length 32.6
  Bottom Layer w0.762: H1.4 48.68,45.21 ; 48.68,45.21 48.68,24.11 2.4 ; 48.68,45.21 45.88,42.42 PROPELLER.D21
SRX0: length 47.3
  Top Layer w0.762: DEPTH_SESNOR2.2 66.2,57.66 68.74,55.12 99.22,55.12 101.13,53.21 101.13,46.23 SECONDARY.RX0
SSCL: length 70.4
  Bottom Layer w0.762: J1#2.3 59.85,15.75 63.66,15.75 66.2,13.21 81.44,13.21 95.41,27.18 95.41,46.23 SECONDARY.D22
SSDA: length 67.6
  Bottom Layer w0.762: J1#2.4 55.13,12.85 55.13,12.83 55.66,12.29 55.69,12.29 57.31,10.67 80.19,10.67 81.47,11.94 82.71,11.94 96.68,25.91 96.68,41.15 97.95,42.42 SECONDARY.D21
STX0: length 41.8
  Top Layer w0.762: DEPTH_SESNOR2.3 63.66,56.39 66.2,53.85 86.52,53.85 92.87,47.5 SECONDARY.TX0
TX0: length 29.9
  Top Layer w0.762: PROPELLER.TX0 47.15,51.31 47.15,53.85 56.04,62.74 62.39,62.74 63.66,64.01 DEPTH_SESNOR.3

## Copper pours and planes (outline as drawn; the poured copper is in the pictures)
GND on Top Layer: -3.65,71.63 106.84,71.63 104.3,69.09 104.3,4.32 -2.38,4.32
GND on Bottom Layer: -1.11,70.36 104.3,70.36 104.3,5.59 103.03,4.32 -1.11,4.32

## Text on the board
Top Silkscreen Layer: IO23 | IO13 | GND | SIO27 | SSDA | +5v | SSCL | VCC | SIO12 | SIO13 | TX0 | RX0
